# Altium project DUTBoard.PrjPcb (part 4 of 5)
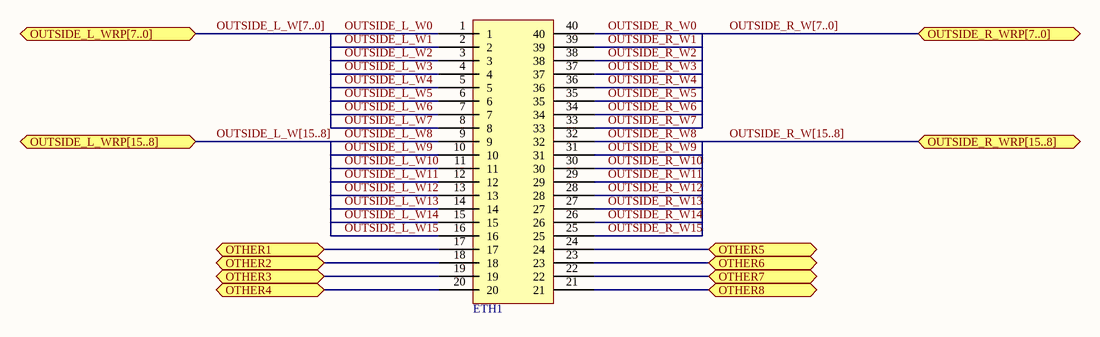
[diagram p14: BOTTOM_HEADER_WRP.SchDoc]
## Nets that join several sheets
GND: U_COUNTER_BANK/U_COUNTER_WRP (C4.GND), U_COUNTER_BANK/U_COUNTER_WRP (C3.GND), U_COUNTER_BANK/U_COUNTER_WRP (C2.GND), U_COUNTER_BANK/U_COUNTER_WRP (C1.GND), U_VT_BANK/U_VT_WRP (0.1uF_1#1.2 0.1uF_2#1.2 V14.GND), U_VT_BANK/U_VT_WRP (0.1uF_1#2.2 0.1uF_2#2.2 V13.GND), U_VT_BANK/U_VT_WRP (0.1uF_1#3.2 0.1uF_2#3.2 V16.GND), U_VT_BANK/U_VT_WRP (0.1uF_1#4.2 0.1uF_2#4.2 V15.GND), U_VT_BANK/U_VT_WRP (0.1uF_1#5.2 0.1uF_2#5.2 V12.GND), U_VT_BANK/U_VT_WRP (0.1uF_1#6.2 0.1uF_2#6.2 V11.GND), U_VT_BANK/U_VT_WRP (0.1uF_1#7.2 0.1uF_2#7.2 V10.GND), U_VT_BANK/U_VT_WRP (0.1uF_1#8.2 0.1uF_2#8.2 V9.GND), U_VT_BANK/U_VT_WRP (0.1uF_1#9.2 0.1uF_2#9.2 V8.GND), U_VT_BANK/U_VT_WRP (0.1uF_1#10.2 0.1uF_2#10.2 V7.GND), U_VT_BANK/U_VT_WRP (0.1uF_1#11.2 0.1uF_2#11.2 V6.GND), U_VT_BANK/U_VT_WRP (0.1uF_1#12.2 0.1uF_2#12.2 V5.GND), U_VT_BANK/U_VT_WRP (0.1uF_1#13.2 0.1uF_2#13.2 V4.GND), U_VT_BANK/U_VT_WRP (0.1uF_1_U_VT_BANK_U_VT_WRP#1.2 0.1uF_2#14.2 V3.GND), U_VT_BANK/U_VT_WRP (0.1uF_1_U_VT_BANK_U_VT_WRP#2.2 0.1uF_2#15.2 V2.GND), U_VT_BANK/U_VT_WRP (0.1uF_1#14.2 0.1uF_2#16.2 V1.GND), U_OB_BANK/U_OB_WRP (OB16.GND), U_OB_BANK/U_OB_WRP (OB15.GND), U_OB_BANK/U_OB_WRP (OB14.GND), U_OB_BANK/U_OB_WRP (OB13.GND), U_OB_BANK/U_OB_WRP (OB12.GND), U_OB_BANK/U_OB_WRP (OB11.GND), U_OB_BANK/U_OB_WRP (OB10.GND), U_OB_BANK/U_OB_WRP (OB9.GND), U_OB_BANK/U_OB_WRP (OB8.GND), U_OB_BANK/U_OB_WRP (OB7.GND), U_OB_BANK/U_OB_WRP (OB6.GND), U_OB_BANK/U_OB_WRP (OB5.GND), U_OB_BANK/U_OB_WRP (OB4.GND), U_OB_BANK/U_OB_WRP (OB3.GND), U_OB_BANK/U_OB_WRP (OB2.GND), U_OB_BANK/U_OB_WRP (OB1.GND), U_SRAM_BANK/U_SRAM_WRP (7 pins), U_SRAM_BANK/U_SRAM_WRP (7 pins), U_SRAM_BANK/U_SRAM_WRP (7 pins), U_SRAM_BANK/U_SRAM_WRP (7 pins), U_SRAM_BANK/U_SRAM_WRP (7 pins), U_SRAM_BANK/U_SRAM_WRP (7 pins), U_SRAM_BANK/U_SRAM_WRP (7 pins), U_SRAM_BANK/U_SRAM_WRP (7 pins), U_HEADER_BANK/U_COMBINED_HEADER_WRP/U_TOP_HEADER_WRP (8 pins), U_HEADER_BANK/U_COMBINED_HEADER_WRP/U_TOP_HEADER_WRP (8 pins), U_HEADER_BANK/U_COMBINED_HEADER_WRP/U_BOTTOM_HEADER_WRP (ETH1_U_BOTTOM_HEADER_WRP4.20 ETH1_U_BOTTOM_HEADER_WRP4.21), U_HEADER_BANK/U_COMBINED_HEADER_WRP/U_TOP_HEADER_WRP (8 pins), U_HEADER_BANK/U_COMBINED_HEADER_WRP/U_TOP_HEADER_WRP (8 pins), U_HEADER_BANK/U_COMBINED_HEADER_WRP/U_BOTTOM_HEADER_WRP (ETH1_U_BOTTOM_HEADER_WRP3.19 ETH1_U_BOTTOM_HEADER_WRP3.20 ETH1_U_BOTTOM_HEADER_WRP3.21), U_HEADER_BANK/U_COMBINED_HEADER_WRP/U_TOP_HEADER_WRP (8 pins), U_HEADER_BANK/U_COMBINED_HEADER_WRP/U_TOP_HEADER_WRP (8 pins), U_HEADER_BANK/U_COMBINED_HEADER_WRP/U_BOTTOM_HEADER_WRP (5 pins), U_HEADER_BANK/U_COMBINED_HEADER_WRP/U_TOP_HEADER_WRP (8 pins), U_HEADER_BANK/U_COMBINED_HEADER_WRP/U_TOP_HEADER_WRP (8 pins)
3V3: U_COUNTER_BANK/U_COUNTER_WRP (C4.VCC), U_COUNTER_BANK/U_COUNTER_WRP (C3.VCC), U_COUNTER_BANK/U_COUNTER_WRP (C2.VCC), U_COUNTER_BANK/U_COUNTER_WRP (C1.VCC), U_VT_BANK/U_VT_WRP (0.1uF_1#1.1 V14.VL), U_VT_BANK/U_VT_WRP (0.1uF_1#2.1 V13.VL), U_VT_BANK/U_VT_WRP (0.1uF_1#3.1 V16.VL), U_VT_BANK/U_VT_WRP (0.1uF_1#4.1 V15.VL), U_VT_BANK/U_VT_WRP (0.1uF_1#5.1 V12.VL), U_VT_BANK/U_VT_WRP (0.1uF_1#6.1 V11.VL), U_VT_BANK/U_VT_WRP (0.1uF_1#7.1 V10.VL), U_VT_BANK/U_VT_WRP (0.1uF_1#8.1 V9.VL), U_VT_BANK/U_VT_WRP (0.1uF_1#9.1 V8.VL), U_VT_BANK/U_VT_WRP (0.1uF_1#10.1 V7.VL), U_VT_BANK/U_VT_WRP (0.1uF_1#11.1 V6.VL), U_VT_BANK/U_VT_WRP (0.1uF_1#12.1 V5.VL), U_VT_BANK/U_VT_WRP (0.1uF_1#13.1 V4.VL), U_VT_BANK/U_VT_WRP (0.1uF_1_U_VT_BANK_U_VT_WRP#1.1 V3.VL), U_VT_BANK/U_VT_WRP (0.1uF_1_U_VT_BANK_U_VT_WRP#2.1 V2.VL), U_VT_BANK/U_VT_WRP (0.1uF_1#14.1 V1.VL), U_OB_BANK/U_OB_WRP (OB16.VCC), U_OB_BANK/U_OB_WRP (OB15.VCC), U_OB_BANK/U_OB_WRP (OB14.VCC), U_OB_BANK/U_OB_WRP (OB13.VCC), U_OB_BANK/U_OB_WRP (OB12.VCC), U_OB_BANK/U_OB_WRP (OB11.VCC), U_OB_BANK/U_OB_WRP (OB10.VCC), U_OB_BANK/U_OB_WRP (OB9.VCC), U_OB_BANK/U_OB_WRP (OB8.VCC), U_OB_BANK/U_OB_WRP (OB7.VCC), U_OB_BANK/U_OB_WRP (OB6.VCC), U_OB_BANK/U_OB_WRP (OB5.VCC), U_OB_BANK/U_OB_WRP (OB4.VCC), U_OB_BANK/U_OB_WRP (OB3.VCC), U_OB_BANK/U_OB_WRP (OB2.VCC), U_OB_BANK/U_OB_WRP (OB1.VCC), U_SRAM_BANK/U_SRAM_WRP (S7.VDD), U_SRAM_BANK/U_SRAM_WRP (S8.VDD), U_SRAM_BANK/U_SRAM_WRP (S6.VDD), U_SRAM_BANK/U_SRAM_WRP (S5.VDD), U_SRAM_BANK/U_SRAM_WRP (S4.VDD), U_SRAM_BANK/U_SRAM_WRP (S3.VDD), U_SRAM_BANK/U_SRAM_WRP (S2.VDD), U_SRAM_BANK/U_SRAM_WRP (S1.VDD), U_HEADER_BANK/U_COMBINED_HEADER_WRP/U_BOTTOM_HEADER_WRP (ETH1_U_BOTTOM_HEADER_WRP3.22)
ADDR_COUNTER_W0: U_COUNTER_BANK/U_COUNTER_WRP (C4.ADDR0), U_SRAM_BANK/U_SRAM_WRP (S7.ADDR0), U_SRAM_BANK/U_SRAM_WRP (S8.ADDR0)
ADDR_COUNTER_W0: U_COUNTER_BANK/U_COUNTER_WRP (C3.ADDR0), U_SRAM_BANK/U_SRAM_WRP (S6.ADDR0), U_SRAM_BANK/U_SRAM_WRP (S5.ADDR0)
ADDR_COUNTER_W0: U_COUNTER_BANK/U_COUNTER_WRP (C2.ADDR0), U_SRAM_BANK/U_SRAM_WRP (S4.ADDR0), U_SRAM_BANK/U_SRAM_WRP (S3.ADDR0)
ADDR_COUNTER_W0: U_COUNTER_BANK/U_COUNTER_WRP (C1.ADDR0), U_SRAM_BANK/U_SRAM_WRP (S2.ADDR0), U_SRAM_BANK/U_SRAM_WRP (S1.ADDR0)
ADDR_COUNTER_W1: U_COUNTER_BANK/U_COUNTER_WRP (C4.ADDR1), U_SRAM_BANK/U_SRAM_WRP (S7.ADDR1), U_SRAM_BANK/U_SRAM_WRP (S8.ADDR1)
ADDR_COUNTER_W1: U_COUNTER_BANK/U_COUNTER_WRP (C3.ADDR1), U_SRAM_BANK/U_SRAM_WRP (S6.ADDR1), U_SRAM_BANK/U_SRAM_WRP (S5.ADDR1)
ADDR_COUNTER_W1: U_COUNTER_BANK/U_COUNTER_WRP (C2.ADDR1), U_SRAM_BANK/U_SRAM_WRP (S4.ADDR1), U_SRAM_BANK/U_SRAM_WRP (S3.ADDR1)
ADDR_COUNTER_W1: U_COUNTER_BANK/U_COUNTER_WRP (C1.ADDR1), U_SRAM_BANK/U_SRAM_WRP (S2.ADDR1), U_SRAM_BANK/U_SRAM_WRP (S1.ADDR1)
ADDR_COUNTER_W2: U_COUNTER_BANK/U_COUNTER_WRP (C4.ADDR2), U_SRAM_BANK/U_SRAM_WRP (S7.ADDR2), U_SRAM_BANK/U_SRAM_WRP (S8.ADDR2)
ADDR_COUNTER_W2: U_COUNTER_BANK/U_COUNTER_WRP (C3.ADDR2), U_SRAM_BANK/U_SRAM_WRP (S6.ADDR2), U_SRAM_BANK/U_SRAM_WRP (S5.ADDR2)
ADDR_COUNTER_W2: U_COUNTER_BANK/U_COUNTER_WRP (C2.ADDR2), U_SRAM_BANK/U_SRAM_WRP (S4.ADDR2), U_SRAM_BANK/U_SRAM_WRP (S3.ADDR2)
ADDR_COUNTER_W2: U_COUNTER_BANK/U_COUNTER_WRP (C1.ADDR2), U_SRAM_BANK/U_SRAM_WRP (S2.ADDR2), U_SRAM_BANK/U_SRAM_WRP (S1.ADDR2)
ADDR_COUNTER_W3: U_COUNTER_BANK/U_COUNTER_WRP (C4.ADDR3), U_SRAM_BANK/U_SRAM_WRP (S7.ADDR3), U_SRAM_BANK/U_SRAM_WRP (S8.ADDR3)
ADDR_COUNTER_W3: U_COUNTER_BANK/U_COUNTER_WRP (C3.ADDR3), U_SRAM_BANK/U_SRAM_WRP (S6.ADDR3), U_SRAM_BANK/U_SRAM_WRP (S5.ADDR3)
ADDR_COUNTER_W3: U_COUNTER_BANK/U_COUNTER_WRP (C2.ADDR3), U_SRAM_BANK/U_SRAM_WRP (S4.ADDR3), U_SRAM_BANK/U_SRAM_WRP (S3.ADDR3)
ADDR_COUNTER_W3: U_COUNTER_BANK/U_COUNTER_WRP (C1.ADDR3), U_SRAM_BANK/U_SRAM_WRP (S2.ADDR3), U_SRAM_BANK/U_SRAM_WRP (S1.ADDR3)
ADDR_COUNTER_W4: U_COUNTER_BANK/U_COUNTER_WRP (C4.ADDR4), U_SRAM_BANK/U_SRAM_WRP (S7.ADDR4), U_SRAM_BANK/U_SRAM_WRP (S8.ADDR4)
ADDR_COUNTER_W4: U_COUNTER_BANK/U_COUNTER_WRP (C3.ADDR4), U_SRAM_BANK/U_SRAM_WRP (S6.ADDR4), U_SRAM_BANK/U_SRAM_WRP (S5.ADDR4)
ADDR_COUNTER_W4: U_COUNTER_BANK/U_COUNTER_WRP (C2.ADDR4), U_SRAM_BANK/U_SRAM_WRP (S4.ADDR4), U_SRAM_BANK/U_SRAM_WRP (S3.ADDR4)
ADDR_COUNTER_W4: U_COUNTER_BANK/U_COUNTER_WRP (C1.ADDR4), U_SRAM_BANK/U_SRAM_WRP (S2.ADDR4), U_SRAM_BANK/U_SRAM_WRP (S1.ADDR4)
ADDR_COUNTER_W5: U_COUNTER_BANK/U_COUNTER_WRP (C4.ADDR5), U_SRAM_BANK/U_SRAM_WRP (S7.ADDR5), U_SRAM_BANK/U_SRAM_WRP (S8.ADDR5)
ADDR_COUNTER_W5: U_COUNTER_BANK/U_COUNTER_WRP (C3.ADDR5), U_SRAM_BANK/U_SRAM_WRP (S6.ADDR5), U_SRAM_BANK/U_SRAM_WRP (S5.ADDR5)
ADDR_COUNTER_W5: U_COUNTER_BANK/U_COUNTER_WRP (C2.ADDR5), U_SRAM_BANK/U_SRAM_WRP (S4.ADDR5), U_SRAM_BANK/U_SRAM_WRP (S3.ADDR5)
ADDR_COUNTER_W5: U_COUNTER_BANK/U_COUNTER_WRP (C1.ADDR5), U_SRAM_BANK/U_SRAM_WRP (S2.ADDR5), U_SRAM_BANK/U_SRAM_WRP (S1.ADDR5)
ADDR_COUNTER_W6: U_COUNTER_BANK/U_COUNTER_WRP (C4.ADDR6), U_SRAM_BANK/U_SRAM_WRP (S7.ADDR6), U_SRAM_BANK/U_SRAM_WRP (S8.ADDR6)
ADDR_COUNTER_W6: U_COUNTER_BANK/U_COUNTER_WRP (C3.ADDR6), U_SRAM_BANK/U_SRAM_WRP (S6.ADDR6), U_SRAM_BANK/U_SRAM_WRP (S5.ADDR6)
ADDR_COUNTER_W6: U_COUNTER_BANK/U_COUNTER_WRP (C2.ADDR6), U_SRAM_BANK/U_SRAM_WRP (S4.ADDR6), U_SRAM_BANK/U_SRAM_WRP (S3.ADDR6)
ADDR_COUNTER_W6: U_COUNTER_BANK/U_COUNTER_WRP (C1.ADDR6), U_SRAM_BANK/U_SRAM_WRP (S2.ADDR6), U_SRAM_BANK/U_SRAM_WRP (S1.ADDR6)
ADDR_COUNTER_W7: U_COUNTER_BANK/U_COUNTER_WRP (C4.ADDR7), U_SRAM_BANK/U_SRAM_WRP (S7.ADDR7), U_SRAM_BANK/U_SRAM_WRP (S8.ADDR7)
ADDR_COUNTER_W7: U_COUNTER_BANK/U_COUNTER_WRP (C3.ADDR7), U_SRAM_BANK/U_SRAM_WRP (S6.ADDR7), U_SRAM_BANK/U_SRAM_WRP (S5.ADDR7)
ADDR_COUNTER_W7: U_COUNTER_BANK/U_COUNTER_WRP (C2.ADDR7), U_SRAM_BANK/U_SRAM_WRP (S4.ADDR7), U_SRAM_BANK/U_SRAM_WRP (S3.ADDR7)
ADDR_COUNTER_W7: U_COUNTER_BANK/U_COUNTER_WRP (C1.ADDR7), U_SRAM_BANK/U_SRAM_WRP (S2.ADDR7), U_SRAM_BANK/U_SRAM_WRP (S1.ADDR7)
ADDR_COUNTER_W8: U_COUNTER_BANK/U_COUNTER_WRP (C4.ADDR8), U_SRAM_BANK/U_SRAM_WRP (S7.ADDR8), U_SRAM_BANK/U_SRAM_WRP (S8.ADDR8)
ADDR_COUNTER_W8: U_COUNTER_BANK/U_COUNTER_WRP (C3.ADDR8), U_SRAM_BANK/U_SRAM_WRP (S6.ADDR8), U_SRAM_BANK/U_SRAM_WRP (S5.ADDR8)
ADDR_COUNTER_W8: U_COUNTER_BANK/U_COUNTER_WRP (C2.ADDR8), U_SRAM_BANK/U_SRAM_WRP (S4.ADDR8), U_SRAM_BANK/U_SRAM_WRP (S3.ADDR8)
ADDR_COUNTER_W8: U_COUNTER_BANK/U_COUNTER_WRP (C1.ADDR8), U_SRAM_BANK/U_SRAM_WRP (S2.ADDR8), U_SRAM_BANK/U_SRAM_WRP (S1.ADDR8)
ADDR_COUNTER_W9: U_COUNTER_BANK/U_COUNTER_WRP (C4.ADDR9), U_SRAM_BANK/U_SRAM_WRP (S7.ADDR9), U_SRAM_BANK/U_SRAM_WRP (S8.ADDR9)
ADDR_COUNTER_W9: U_COUNTER_BANK/U_COUNTER_WRP (C3.ADDR9), U_SRAM_BANK/U_SRAM_WRP (S6.ADDR9), U_SRAM_BANK/U_SRAM_WRP (S5.ADDR9)
ADDR_COUNTER_W9: U_COUNTER_BANK/U_COUNTER_WRP (C2.ADDR9), U_SRAM_BANK/U_SRAM_WRP (S4.ADDR9), U_SRAM_BANK/U_SRAM_WRP (S3.ADDR9)
ADDR_COUNTER_W9: U_COUNTER_BANK/U_COUNTER_WRP (C1.ADDR9), U_SRAM_BANK/U_SRAM_WRP (S2.ADDR9), U_SRAM_BANK/U_SRAM_WRP (S1.ADDR9)
ADDR_COUNTER_W10: U_COUNTER_BANK/U_COUNTER_WRP (C4.ADDR10), U_SRAM_BANK/U_SRAM_WRP (S7.ADDR10), U_SRAM_BANK/U_SRAM_WRP (S8.ADDR10)
ADDR_COUNTER_W10: U_COUNTER_BANK/U_COUNTER_WRP (C3.ADDR10), U_SRAM_BANK/U_SRAM_WRP (S6.ADDR10), U_SRAM_BANK/U_SRAM_WRP (S5.ADDR10)
ADDR_COUNTER_W10: U_COUNTER_BANK/U_COUNTER_WRP (C2.ADDR10), U_SRAM_BANK/U_SRAM_WRP (S4.ADDR10), U_SRAM_BANK/U_SRAM_WRP (S3.ADDR10)
ADDR_COUNTER_W10: U_COUNTER_BANK/U_COUNTER_WRP (C1.ADDR10), U_SRAM_BANK/U_SRAM_WRP (S2.ADDR10), U_SRAM_BANK/U_SRAM_WRP (S1.ADDR10)
ADDR_COUNTER_W11: U_COUNTER_BANK/U_COUNTER_WRP (C4.ADDR11), U_SRAM_BANK/U_SRAM_WRP (S7.ADDR11), U_SRAM_BANK/U_SRAM_WRP (S8.ADDR11)
ADDR_COUNTER_W11: U_COUNTER_BANK/U_COUNTER_WRP (C3.ADDR11), U_SRAM_BANK/U_SRAM_WRP (S6.ADDR11), U_SRAM_BANK/U_SRAM_WRP (S5.ADDR11)
ADDR_COUNTER_W11: U_COUNTER_BANK/U_COUNTER_WRP (C2.ADDR11), U_SRAM_BANK/U_SRAM_WRP (S4.ADDR11), U_SRAM_BANK/U_SRAM_WRP (S3.ADDR11)
ADDR_COUNTER_W11: U_COUNTER_BANK/U_COUNTER_WRP (C1.ADDR11), U_SRAM_BANK/U_SRAM_WRP (S2.ADDR11), U_SRAM_BANK/U_SRAM_WRP (S1.ADDR11)
CLK_1: U_COUNTER_BANK/U_COUNTER_WRP (C4.~CLK), U_HEADER_BANK/U_COMBINED_HEADER_WRP/U_BOTTOM_HEADER_WRP (ETH1_U_BOTTOM_HEADER_WRP4.17)
CLK_2: U_COUNTER_BANK/U_COUNTER_WRP (C3.~CLK), U_HEADER_BANK/U_COMBINED_HEADER_WRP/U_BOTTOM_HEADER_WRP (ETH1_U_BOTTOM_HEADER_WRP3.17)
CLK_3: U_COUNTER_BANK/U_COUNTER_WRP (C2.~CLK), U_HEADER_BANK/U_COMBINED_HEADER_WRP/U_BOTTOM_HEADER_WRP (ETH1_U_BOTTOM_HEADER_WRP2.17)
CLK_4: U_COUNTER_BANK/U_COUNTER_WRP (C1.~CLK), U_HEADER_BANK/U_COMBINED_HEADER_WRP/U_BOTTOM_HEADER_WRP (ETH1_U_BOTTOM_HEADER_WRP1.17)
CLR_COUNTER_W: U_COUNTER_BANK/U_COUNTER_WRP (C4.CLR), U_COUNTER_BANK/U_COUNTER_WRP (C3.CLR), U_COUNTER_BANK/U_COUNTER_WRP (C2.CLR), U_COUNTER_BANK/U_COUNTER_WRP (C1.CLR), U_HEADER_BANK/U_COMBINED_HEADER_WRP/U_BOTTOM_HEADER_WRP (ETH1_U_BOTTOM_HEADER_WRP4.18)
D_W0: U_VT_BANK/U_VT_WRP (V14.OVL0), U_OB_BANK/U_OB_WRP (OB16.D0), U_SRAM_BANK/U_SRAM_WRP (S7.DATA0)
D_W0: U_VT_BANK/U_VT_WRP (V13.OVL0), U_OB_BANK/U_OB_WRP (OB15.D0), U_SRAM_BANK/U_SRAM_WRP (S7.DATA8)
D_W0: U_VT_BANK/U_VT_WRP (V16.OVL0), U_OB_BANK/U_OB_WRP (OB14.D0), U_SRAM_BANK/U_SRAM_WRP (S8.DATA0)
D_W0: U_VT_BANK/U_VT_WRP (V15.OVL0), U_OB_BANK/U_OB_WRP (OB13.D0), U_SRAM_BANK/U_SRAM_WRP (S8.DATA8)
D_W0: U_VT_BANK/U_VT_WRP (V12.OVL0), U_OB_BANK/U_OB_WRP (OB12.D0), U_SRAM_BANK/U_SRAM_WRP (S6.DATA0)
D_W0: U_VT_BANK/U_VT_WRP (V11.OVL0), U_OB_BANK/U_OB_WRP (OB11.D0), U_SRAM_BANK/U_SRAM_WRP (S6.DATA8)
D_W0: U_VT_BANK/U_VT_WRP (V10.OVL0), U_OB_BANK/U_OB_WRP (OB10.D0), U_SRAM_BANK/U_SRAM_WRP (S5.DATA0)
D_W0: U_VT_BANK/U_VT_WRP (V9.OVL0), U_OB_BANK/U_OB_WRP (OB9.D0), U_SRAM_BANK/U_SRAM_WRP (S5.DATA8)
D_W0: U_VT_BANK/U_VT_WRP (V8.OVL0), U_OB_BANK/U_OB_WRP (OB8.D0), U_SRAM_BANK/U_SRAM_WRP (S4.DATA0)
D_W0: U_VT_BANK/U_VT_WRP (V7.OVL0), U_OB_BANK/U_OB_WRP (OB7.D0), U_SRAM_BANK/U_SRAM_WRP (S4.DATA8)
D_W0: U_VT_BANK/U_VT_WRP (V6.OVL0), U_OB_BANK/U_OB_WRP (OB6.D0), U_SRAM_BANK/U_SRAM_WRP (S3.DATA0)
D_W0: U_VT_BANK/U_VT_WRP (V5.OVL0), U_OB_BANK/U_OB_WRP (OB5.D0), U_SRAM_BANK/U_SRAM_WRP (S3.DATA8)
D_W0: U_VT_BANK/U_VT_WRP (V4.OVL0), U_OB_BANK/U_OB_WRP (OB4.D0), U_SRAM_BANK/U_SRAM_WRP (S2.DATA0)
D_W0: U_VT_BANK/U_VT_WRP (V3.OVL0), U_OB_BANK/U_OB_WRP (OB3.D0), U_SRAM_BANK/U_SRAM_WRP (S2.DATA8)
D_W0: U_VT_BANK/U_VT_WRP (V2.OVL0), U_OB_BANK/U_OB_WRP (OB2.D0), U_SRAM_BANK/U_SRAM_WRP (S1.DATA0)
D_W0: U_VT_BANK/U_VT_WRP (V1.OVL0), U_OB_BANK/U_OB_WRP (OB1.D0), U_SRAM_BANK/U_SRAM_WRP (S1.DATA8)
D_W1: U_VT_BANK/U_VT_WRP (V14.OVL1), U_OB_BANK/U_OB_WRP (OB16.D1), U_SRAM_BANK/U_SRAM_WRP (S7.DATA1)
D_W1: U_VT_BANK/U_VT_WRP (V13.OVL1), U_OB_BANK/U_OB_WRP (OB15.D1), U_SRAM_BANK/U_SRAM_WRP (S7.DATA9)
D_W1: U_VT_BANK/U_VT_WRP (V16.OVL1), U_OB_BANK/U_OB_WRP (OB14.D1), U_SRAM_BANK/U_SRAM_WRP (S8.DATA1)
D_W1: U_VT_BANK/U_VT_WRP (V15.OVL1), U_OB_BANK/U_OB_WRP (OB13.D1), U_SRAM_BANK/U_SRAM_WRP (S8.DATA9)
D_W1: U_VT_BANK/U_VT_WRP (V12.OVL1), U_OB_BANK/U_OB_WRP (OB12.D1), U_SRAM_BANK/U_SRAM_WRP (S6.DATA1)
D_W1: U_VT_BANK/U_VT_WRP (V11.OVL1), U_OB_BANK/U_OB_WRP (OB11.D1), U_SRAM_BANK/U_SRAM_WRP (S6.DATA9)
D_W1: U_VT_BANK/U_VT_WRP (V10.OVL1), U_OB_BANK/U_OB_WRP (OB10.D1), U_SRAM_BANK/U_SRAM_WRP (S5.DATA1)
D_W1: U_VT_BANK/U_VT_WRP (V9.OVL1), U_OB_BANK/U_OB_WRP (OB9.D1), U_SRAM_BANK/U_SRAM_WRP (S5.DATA9)
D_W1: U_VT_BANK/U_VT_WRP (V8.OVL1), U_OB_BANK/U_OB_WRP (OB8.D1), U_SRAM_BANK/U_SRAM_WRP (S4.DATA1)
D_W1: U_VT_BANK/U_VT_WRP (V7.OVL1), U_OB_BANK/U_OB_WRP (OB7.D1), U_SRAM_BANK/U_SRAM_WRP (S4.DATA9)
D_W1: U_VT_BANK/U_VT_WRP (V6.OVL1), U_OB_BANK/U_OB_WRP (OB6.D1), U_SRAM_BANK/U_SRAM_WRP (S3.DATA1)
D_W1: U_VT_BANK/U_VT_WRP (V5.OVL1), U_OB_BANK/U_OB_WRP (OB5.D1), U_SRAM_BANK/U_SRAM_WRP (S3.DATA9)
D_W1: U_VT_BANK/U_VT_WRP (V4.OVL1), U_OB_BANK/U_OB_WRP (OB4.D1), U_SRAM_BANK/U_SRAM_WRP (S2.DATA1)
D_W1: U_VT_BANK/U_VT_WRP (V3.OVL1), U_OB_BANK/U_OB_WRP (OB3.D1), U_SRAM_BANK/U_SRAM_WRP (S2.DATA9)
D_W1: U_VT_BANK/U_VT_WRP (V2.OVL1), U_OB_BANK/U_OB_WRP (OB2.D1), U_SRAM_BANK/U_SRAM_WRP (S1.DATA1)
D_W1: U_VT_BANK/U_VT_WRP (V1.OVL1), U_OB_BANK/U_OB_WRP (OB1.D1), U_SRAM_BANK/U_SRAM_WRP (S1.DATA9)
D_W2: U_VT_BANK/U_VT_WRP (V14.OVL2), U_OB_BANK/U_OB_WRP (OB16.D2), U_SRAM_BANK/U_SRAM_WRP (S7.DATA2)
D_W2: U_VT_BANK/U_VT_WRP (V13.OVL2), U_OB_BANK/U_OB_WRP (OB15.D2), U_SRAM_BANK/U_SRAM_WRP (S7.DATA10)
D_W2: U_VT_BANK/U_VT_WRP (V16.OVL2), U_OB_BANK/U_OB_WRP (OB14.D2), U_SRAM_BANK/U_SRAM_WRP (S8.DATA2)
D_W2: U_VT_BANK/U_VT_WRP (V15.OVL2), U_OB_BANK/U_OB_WRP (OB13.D2), U_SRAM_BANK/U_SRAM_WRP (S8.DATA10)
D_W2: U_VT_BANK/U_VT_WRP (V12.OVL2), U_OB_BANK/U_OB_WRP (OB12.D2), U_SRAM_BANK/U_SRAM_WRP (S6.DATA2)
D_W2: U_VT_BANK/U_VT_WRP (V11.OVL2), U_OB_BANK/U_OB_WRP (OB11.D2), U_SRAM_BANK/U_SRAM_WRP (S6.DATA10)
D_W2: U_VT_BANK/U_VT_WRP (V10.OVL2), U_OB_BANK/U_OB_WRP (OB10.D2), U_SRAM_BANK/U_SRAM_WRP (S5.DATA2)
D_W2: U_VT_BANK/U_VT_WRP (V9.OVL2), U_OB_BANK/U_OB_WRP (OB9.D2), U_SRAM_BANK/U_SRAM_WRP (S5.DATA10)
D_W2: U_VT_BANK/U_VT_WRP (V8.OVL2), U_OB_BANK/U_OB_WRP (OB8.D2), U_SRAM_BANK/U_SRAM_WRP (S4.DATA2)
D_W2: U_VT_BANK/U_VT_WRP (V7.OVL2), U_OB_BANK/U_OB_WRP (OB7.D2), U_SRAM_BANK/U_SRAM_WRP (S4.DATA10)
D_W2: U_VT_BANK/U_VT_WRP (V6.OVL2), U_OB_BANK/U_OB_WRP (OB6.D2), U_SRAM_BANK/U_SRAM_WRP (S3.DATA2)
D_W2: U_VT_BANK/U_VT_WRP (V5.OVL2), U_OB_BANK/U_OB_WRP (OB5.D2), U_SRAM_BANK/U_SRAM_WRP (S3.DATA10)
D_W2: U_VT_BANK/U_VT_WRP (V4.OVL2), U_OB_BANK/U_OB_WRP (OB4.D2), U_SRAM_BANK/U_SRAM_WRP (S2.DATA2)
D_W2: U_VT_BANK/U_VT_WRP (V3.OVL2), U_OB_BANK/U_OB_WRP (OB3.D2), U_SRAM_BANK/U_SRAM_WRP (S2.DATA10)
D_W2: U_VT_BANK/U_VT_WRP (V2.OVL2), U_OB_BANK/U_OB_WRP (OB2.D2), U_SRAM_BANK/U_SRAM_WRP (S1.DATA2)
D_W2: U_VT_BANK/U_VT_WRP (V1.OVL2), U_OB_BANK/U_OB_WRP (OB1.D2), U_SRAM_BANK/U_SRAM_WRP (S1.DATA10)
D_W3: U_VT_BANK/U_VT_WRP (V14.OVL3), U_OB_BANK/U_OB_WRP (OB16.D3), U_SRAM_BANK/U_SRAM_WRP (S7.DATA3)
D_W3: U_VT_BANK/U_VT_WRP (V13.OVL3), U_OB_BANK/U_OB_WRP (OB15.D3), U_SRAM_BANK/U_SRAM_WRP (S7.DATA11)
D_W3: U_VT_BANK/U_VT_WRP (V16.OVL3), U_OB_BANK/U_OB_WRP (OB14.D3), U_SRAM_BANK/U_SRAM_WRP (S8.DATA3)
D_W3: U_VT_BANK/U_VT_WRP (V15.OVL3), U_OB_BANK/U_OB_WRP (OB13.D3), U_SRAM_BANK/U_SRAM_WRP (S8.DATA11)
D_W3: U_VT_BANK/U_VT_WRP (V12.OVL3), U_OB_BANK/U_OB_WRP (OB12.D3), U_SRAM_BANK/U_SRAM_WRP (S6.DATA3)
D_W3: U_VT_BANK/U_VT_WRP (V11.OVL3), U_OB_BANK/U_OB_WRP (OB11.D3), U_SRAM_BANK/U_SRAM_WRP (S6.DATA11)
D_W3: U_VT_BANK/U_VT_WRP (V10.OVL3), U_OB_BANK/U_OB_WRP (OB10.D3), U_SRAM_BANK/U_SRAM_WRP (S5.DATA3)
D_W3: U_VT_BANK/U_VT_WRP (V9.OVL3), U_OB_BANK/U_OB_WRP (OB9.D3), U_SRAM_BANK/U_SRAM_WRP (S5.DATA11)
D_W3: U_VT_BANK/U_VT_WRP (V8.OVL3), U_OB_BANK/U_OB_WRP (OB8.D3), U_SRAM_BANK/U_SRAM_WRP (S4.DATA3)
D_W3: U_VT_BANK/U_VT_WRP (V7.OVL3), U_OB_BANK/U_OB_WRP (OB7.D3), U_SRAM_BANK/U_SRAM_WRP (S4.DATA11)
D_W3: U_VT_BANK/U_VT_WRP (V6.OVL3), U_OB_BANK/U_OB_WRP (OB6.D3), U_SRAM_BANK/U_SRAM_WRP (S3.DATA3)
D_W3: U_VT_BANK/U_VT_WRP (V5.OVL3), U_OB_BANK/U_OB_WRP (OB5.D3), U_SRAM_BANK/U_SRAM_WRP (S3.DATA11)
D_W3: U_VT_BANK/U_VT_WRP (V4.OVL3), U_OB_BANK/U_OB_WRP (OB4.D3), U_SRAM_BANK/U_SRAM_WRP (S2.DATA3)
D_W3: U_VT_BANK/U_VT_WRP (V3.OVL3), U_OB_BANK/U_OB_WRP (OB3.D3), U_SRAM_BANK/U_SRAM_WRP (S2.DATA11)
D_W3: U_VT_BANK/U_VT_WRP (V2.OVL3), U_OB_BANK/U_OB_WRP (OB2.D3), U_SRAM_BANK/U_SRAM_WRP (S1.DATA3)
D_W3: U_VT_BANK/U_VT_WRP (V1.OVL3), U_OB_BANK/U_OB_WRP (OB1.D3), U_SRAM_BANK/U_SRAM_WRP (S1.DATA11)
D_W4: U_VT_BANK/U_VT_WRP (V14.OVL4), U_OB_BANK/U_OB_WRP (OB16.D4), U_SRAM_BANK/U_SRAM_WRP (S7.DATA4)
D_W4: U_VT_BANK/U_VT_WRP (V13.OVL4), U_OB_BANK/U_OB_WRP (OB15.D4), U_SRAM_BANK/U_SRAM_WRP (S7.DATA12)
D_W4: U_VT_BANK/U_VT_WRP (V16.OVL4), U_OB_BANK/U_OB_WRP (OB14.D4), U_SRAM_BANK/U_SRAM_WRP (S8.DATA4)
D_W4: U_VT_BANK/U_VT_WRP (V15.OVL4), U_OB_BANK/U_OB_WRP (OB13.D4), U_SRAM_BANK/U_SRAM_WRP (S8.DATA12)
D_W4: U_VT_BANK/U_VT_WRP (V12.OVL4), U_OB_BANK/U_OB_WRP (OB12.D4), U_SRAM_BANK/U_SRAM_WRP (S6.DATA4)
D_W4: U_VT_BANK/U_VT_WRP (V11.OVL4), U_OB_BANK/U_OB_WRP (OB11.D4), U_SRAM_BANK/U_SRAM_WRP (S6.DATA12)
D_W4: U_VT_BANK/U_VT_WRP (V10.OVL4), U_OB_BANK/U_OB_WRP (OB10.D4), U_SRAM_BANK/U_SRAM_WRP (S5.DATA4)
D_W4: U_VT_BANK/U_VT_WRP (V9.OVL4), U_OB_BANK/U_OB_WRP (OB9.D4), U_SRAM_BANK/U_SRAM_WRP (S5.DATA12)
D_W4: U_VT_BANK/U_VT_WRP (V8.OVL4), U_OB_BANK/U_OB_WRP (OB8.D4), U_SRAM_BANK/U_SRAM_WRP (S4.DATA4)
D_W4: U_VT_BANK/U_VT_WRP (V7.OVL4), U_OB_BANK/U_OB_WRP (OB7.D4), U_SRAM_BANK/U_SRAM_WRP (S4.DATA12)
D_W4: U_VT_BANK/U_VT_WRP (V6.OVL4), U_OB_BANK/U_OB_WRP (OB6.D4), U_SRAM_BANK/U_SRAM_WRP (S3.DATA4)
D_W4: U_VT_BANK/U_VT_WRP (V5.OVL4), U_OB_BANK/U_OB_WRP (OB5.D4), U_SRAM_BANK/U_SRAM_WRP (S3.DATA12)
D_W4: U_VT_BANK/U_VT_WRP (V4.OVL4), U_OB_BANK/U_OB_WRP (OB4.D4), U_SRAM_BANK/U_SRAM_WRP (S2.DATA4)
D_W4: U_VT_BANK/U_VT_WRP (V3.OVL4), U_OB_BANK/U_OB_WRP (OB3.D4), U_SRAM_BANK/U_SRAM_WRP (S2.DATA12)
D_W4: U_VT_BANK/U_VT_WRP (V2.OVL4), U_OB_BANK/U_OB_WRP (OB2.D4), U_SRAM_BANK/U_SRAM_WRP (S1.DATA4)
D_W4: U_VT_BANK/U_VT_WRP (V1.OVL4), U_OB_BANK/U_OB_WRP (OB1.D4), U_SRAM_BANK/U_SRAM_WRP (S1.DATA12)
D_W5: U_VT_BANK/U_VT_WRP (V14.OVL5), U_OB_BANK/U_OB_WRP (OB16.D5), U_SRAM_BANK/U_SRAM_WRP (S7.DATA5)
D_W5: U_VT_BANK/U_VT_WRP (V13.OVL5), U_OB_BANK/U_OB_WRP (OB15.D5), U_SRAM_BANK/U_SRAM_WRP (S7.DATA13)
D_W5: U_VT_BANK/U_VT_WRP (V16.OVL5), U_OB_BANK/U_OB_WRP (OB14.D5), U_SRAM_BANK/U_SRAM_WRP (S8.DATA5)
D_W5: U_VT_BANK/U_VT_WRP (V15.OVL5), U_OB_BANK/U_OB_WRP (OB13.D5), U_SRAM_BANK/U_SRAM_WRP (S8.DATA13)
D_W5: U_VT_BANK/U_VT_WRP (V12.OVL5), U_OB_BANK/U_OB_WRP (OB12.D5), U_SRAM_BANK/U_SRAM_WRP (S6.DATA5)
D_W5: U_VT_BANK/U_VT_WRP (V11.OVL5), U_OB_BANK/U_OB_WRP (OB11.D5), U_SRAM_BANK/U_SRAM_WRP (S6.DATA13)
D_W5: U_VT_BANK/U_VT_WRP (V10.OVL5), U_OB_BANK/U_OB_WRP (OB10.D5), U_SRAM_BANK/U_SRAM_WRP (S5.DATA5)
D_W5: U_VT_BANK/U_VT_WRP (V9.OVL5), U_OB_BANK/U_OB_WRP (OB9.D5), U_SRAM_BANK/U_SRAM_WRP (S5.DATA13)
D_W5: U_VT_BANK/U_VT_WRP (V8.OVL5), U_OB_BANK/U_OB_WRP (OB8.D5), U_SRAM_BANK/U_SRAM_WRP (S4.DATA5)
D_W5: U_VT_BANK/U_VT_WRP (V7.OVL5), U_OB_BANK/U_OB_WRP (OB7.D5), U_SRAM_BANK/U_SRAM_WRP (S4.DATA13)
D_W5: U_VT_BANK/U_VT_WRP (V6.OVL5), U_OB_BANK/U_OB_WRP (OB6.D5), U_SRAM_BANK/U_SRAM_WRP (S3.DATA5)
D_W5: U_VT_BANK/U_VT_WRP (V5.OVL5), U_OB_BANK/U_OB_WRP (OB5.D5), U_SRAM_BANK/U_SRAM_WRP (S3.DATA13)
D_W5: U_VT_BANK/U_VT_WRP (V4.OVL5), U_OB_BANK/U_OB_WRP (OB4.D5), U_SRAM_BANK/U_SRAM_WRP (S2.DATA5)
D_W5: U_VT_BANK/U_VT_WRP (V3.OVL5), U_OB_BANK/U_OB_WRP (OB3.D5), U_SRAM_BANK/U_SRAM_WRP (S2.DATA13)
D_W5: U_VT_BANK/U_VT_WRP (V2.OVL5), U_OB_BANK/U_OB_WRP (OB2.D5), U_SRAM_BANK/U_SRAM_WRP (S1.DATA5)
D_W5: U_VT_BANK/U_VT_WRP (V1.OVL5), U_OB_BANK/U_OB_WRP (OB1.D5), U_SRAM_BANK/U_SRAM_WRP (S1.DATA13)
D_W6: U_VT_BANK/U_VT_WRP (V14.OVL6), U_OB_BANK/U_OB_WRP (OB16.D6), U_SRAM_BANK/U_SRAM_WRP (S7.DATA6)
D_W6: U_VT_BANK/U_VT_WRP (V13.OVL6), U_OB_BANK/U_OB_WRP (OB15.D6), U_SRAM_BANK/U_SRAM_WRP (S7.DATA14)
D_W6: U_VT_BANK/U_VT_WRP (V16.OVL6), U_OB_BANK/U_OB_WRP (OB14.D6), U_SRAM_BANK/U_SRAM_WRP (S8.DATA6)
D_W6: U_VT_BANK/U_VT_WRP (V15.OVL6), U_OB_BANK/U_OB_WRP (OB13.D6), U_SRAM_BANK/U_SRAM_WRP (S8.DATA14)
D_W6: U_VT_BANK/U_VT_WRP (V12.OVL6), U_OB_BANK/U_OB_WRP (OB12.D6), U_SRAM_BANK/U_SRAM_WRP (S6.DATA6)
D_W6: U_VT_BANK/U_VT_WRP (V11.OVL6), U_OB_BANK/U_OB_WRP (OB11.D6), U_SRAM_BANK/U_SRAM_WRP (S6.DATA14)
D_W6: U_VT_BANK/U_VT_WRP (V10.OVL6), U_OB_BANK/U_OB_WRP (OB10.D6), U_SRAM_BANK/U_SRAM_WRP (S5.DATA6)
D_W6: U_VT_BANK/U_VT_WRP (V9.OVL6), U_OB_BANK/U_OB_WRP (OB9.D6), U_SRAM_BANK/U_SRAM_WRP (S5.DATA14)
D_W6: U_VT_BANK/U_VT_WRP (V8.OVL6), U_OB_BANK/U_OB_WRP (OB8.D6), U_SRAM_BANK/U_SRAM_WRP (S4.DATA6)
D_W6: U_VT_BANK/U_VT_WRP (V7.OVL6), U_OB_BANK/U_OB_WRP (OB7.D6), U_SRAM_BANK/U_SRAM_WRP (S4.DATA14)
D_W6: U_VT_BANK/U_VT_WRP (V6.OVL6), U_OB_BANK/U_OB_WRP (OB6.D6), U_SRAM_BANK/U_SRAM_WRP (S3.DATA6)
D_W6: U_VT_BANK/U_VT_WRP (V5.OVL6), U_OB_BANK/U_OB_WRP (OB5.D6), U_SRAM_BANK/U_SRAM_WRP (S3.DATA14)
D_W6: U_VT_BANK/U_VT_WRP (V4.OVL6), U_OB_BANK/U_OB_WRP (OB4.D6), U_SRAM_BANK/U_SRAM_WRP (S2.DATA6)
D_W6: U_VT_BANK/U_VT_WRP (V3.OVL6), U_OB_BANK/U_OB_WRP (OB3.D6), U_SRAM_BANK/U_SRAM_WRP (S2.DATA14)
D_W6: U_VT_BANK/U_VT_WRP (V2.OVL6), U_OB_BANK/U_OB_WRP (OB2.D6), U_SRAM_BANK/U_SRAM_WRP (S1.DATA6)
D_W6: U_VT_BANK/U_VT_WRP (V1.OVL6), U_OB_BANK/U_OB_WRP (OB1.D6), U_SRAM_BANK/U_SRAM_WRP (S1.DATA14)
D_W7: U_VT_BANK/U_VT_WRP (V14.OVL7), U_OB_BANK/U_OB_WRP (OB16.D7), U_SRAM_BANK/U_SRAM_WRP (S7.DATA7)
D_W7: U_VT_BANK/U_VT_WRP (V13.OVL7), U_OB_BANK/U_OB_WRP (OB15.D7), U_SRAM_BANK/U_SRAM_WRP (S7.DATA15)
D_W7: U_VT_BANK/U_VT_WRP (V16.OVL7), U_OB_BANK/U_OB_WRP (OB14.D7), U_SRAM_BANK/U_SRAM_WRP (S8.DATA7)
D_W7: U_VT_BANK/U_VT_WRP (V15.OVL7), U_OB_BANK/U_OB_WRP (OB13.D7), U_SRAM_BANK/U_SRAM_WRP (S8.DATA15)
D_W7: U_VT_BANK/U_VT_WRP (V12.OVL7), U_OB_BANK/U_OB_WRP (OB12.D7), U_SRAM_BANK/U_SRAM_WRP (S6.DATA7)
D_W7: U_VT_BANK/U_VT_WRP (V11.OVL7), U_OB_BANK/U_OB_WRP (OB11.D7), U_SRAM_BANK/U_SRAM_WRP (S6.DATA15)
D_W7: U_VT_BANK/U_VT_WRP (V10.OVL7), U_OB_BANK/U_OB_WRP (OB10.D7), U_SRAM_BANK/U_SRAM_WRP (S5.DATA7)
D_W7: U_VT_BANK/U_VT_WRP (V9.OVL7), U_OB_BANK/U_OB_WRP (OB9.D7), U_SRAM_BANK/U_SRAM_WRP (S5.DATA15)
D_W7: U_VT_BANK/U_VT_WRP (V8.OVL7), U_OB_BANK/U_OB_WRP (OB8.D7), U_SRAM_BANK/U_SRAM_WRP (S4.DATA7)
D_W7: U_VT_BANK/U_VT_WRP (V7.OVL7), U_OB_BANK/U_OB_WRP (OB7.D7), U_SRAM_BANK/U_SRAM_WRP (S4.DATA15)
D_W7: U_VT_BANK/U_VT_WRP (V6.OVL7), U_OB_BANK/U_OB_WRP (OB6.D7), U_SRAM_BANK/U_SRAM_WRP (S3.DATA7)
D_W7: U_VT_BANK/U_VT_WRP (V5.OVL7), U_OB_BANK/U_OB_WRP (OB5.D7), U_SRAM_BANK/U_SRAM_WRP (S3.DATA15)
D_W7: U_VT_BANK/U_VT_WRP (V4.OVL7), U_OB_BANK/U_OB_WRP (OB4.D7), U_SRAM_BANK/U_SRAM_WRP (S2.DATA7)
D_W7: U_VT_BANK/U_VT_WRP (V3.OVL7), U_OB_BANK/U_OB_WRP (OB3.D7), U_SRAM_BANK/U_SRAM_WRP (S2.DATA15)
D_W7: U_VT_BANK/U_VT_WRP (V2.OVL7), U_OB_BANK/U_OB_WRP (OB2.D7), U_SRAM_BANK/U_SRAM_WRP (S1.DATA7)
D_W7: U_VT_BANK/U_VT_WRP (V1.OVL7), U_OB_BANK/U_OB_WRP (OB1.D7), U_SRAM_BANK/U_SRAM_WRP (S1.DATA15)
EN: U_VT_BANK/U_VT_WRP (V14.EN), U_VT_BANK/U_VT_WRP (V13.EN), U_VT_BANK/U_VT_WRP (V16.EN), U_VT_BANK/U_VT_WRP (V15.EN), U_VT_BANK/U_VT_WRP (V12.EN), U_VT_BANK/U_VT_WRP (V11.EN), U_VT_BANK/U_VT_WRP (V10.EN), U_VT_BANK/U_VT_WRP (V9.EN), U_VT_BANK/U_VT_WRP (V8.EN), U_VT_BANK/U_VT_WRP (V7.EN), U_VT_BANK/U_VT_WRP (V6.EN), U_VT_BANK/U_VT_WRP (V5.EN), U_VT_BANK/U_VT_WRP (V4.EN), U_VT_BANK/U_VT_WRP (V3.EN), U_VT_BANK/U_VT_WRP (V2.EN), U_VT_BANK/U_VT_WRP (V1.EN), U_HEADER_BANK/U_COMBINED_HEADER_WRP/U_BOTTOM_HEADER_WRP (ETH1_U_BOTTOM_HEADER_WRP4.19)
FPGA_Q: U_OB_BANK/U_OB_WRP (OB1.Q), U_HEADER_BANK/U_COMBINED_HEADER_WRP/U_BOTTOM_HEADER_WRP (ETH1_U_BOTTOM_HEADER_WRP1.21)
FPGA_SHCP: U_OB_BANK/U_OB_WRP (OB16.SHCP), U_OB_BANK/U_OB_WRP (OB15.SHCP), U_OB_BANK/U_OB_WRP (OB14.SHCP), U_OB_BANK/U_OB_WRP (OB13.SHCP), U_OB_BANK/U_OB_WRP (OB12.SHCP), U_OB_BANK/U_OB_WRP (OB11.SHCP), U_OB_BANK/U_OB_WRP (OB10.SHCP), U_OB_BANK/U_OB_WRP (OB9.SHCP), U_OB_BANK/U_OB_WRP (OB8.SHCP), U_OB_BANK/U_OB_WRP (OB7.SHCP), U_OB_BANK/U_OB_WRP (OB6.SHCP), U_OB_BANK/U_OB_WRP (OB5.SHCP), U_OB_BANK/U_OB_WRP (OB4.SHCP), U_OB_BANK/U_OB_WRP (OB3.SHCP), U_OB_BANK/U_OB_WRP (OB2.SHCP), U_OB_BANK/U_OB_WRP (OB1.SHCP), U_HEADER_BANK/U_COMBINED_HEADER_WRP/U_BOTTOM_HEADER_WRP (ETH1_U_BOTTOM_HEADER_WRP1.19)
FPGA_STCP: U_OB_BANK/U_OB_WRP (OB16.STCP), U_OB_BANK/U_OB_WRP (OB15.STCP), U_OB_BANK/U_OB_WRP (OB14.STCP), U_OB_BANK/U_OB_WRP (OB13.STCP), U_OB_BANK/U_OB_WRP (OB12.STCP), U_OB_BANK/U_OB_WRP (OB11.STCP), U_OB_BANK/U_OB_WRP (OB10.STCP), U_OB_BANK/U_OB_WRP (OB9.STCP), U_OB_BANK/U_OB_WRP (OB8.STCP), U_OB_BANK/U_OB_WRP (OB7.STCP), U_OB_BANK/U_OB_WRP (OB6.STCP), U_OB_BANK/U_OB_WRP (OB5.STCP), U_OB_BANK/U_OB_WRP (OB4.STCP), U_OB_BANK/U_OB_WRP (OB3.STCP), U_OB_BANK/U_OB_WRP (OB2.STCP), U_OB_BANK/U_OB_WRP (OB1.STCP), U_HEADER_BANK/U_COMBINED_HEADER_WRP/U_BOTTOM_HEADER_WRP (ETH1_U_BOTTOM_HEADER_WRP1.18)
FPGA_~CS1: U_SRAM_BANK/U_SRAM_WRP (S7.~CS), U_SRAM_BANK/U_SRAM_WRP (S8.~CS), U_HEADER_BANK/U_COMBINED_HEADER_WRP/U_BOTTOM_HEADER_WRP (ETH1_U_BOTTOM_HEADER_WRP4.24)
FPGA_~CS2: U_SRAM_BANK/U_SRAM_WRP (S6.~CS), U_SRAM_BANK/U_SRAM_WRP (S5.~CS), U_HEADER_BANK/U_COMBINED_HEADER_WRP/U_BOTTOM_HEADER_WRP (ETH1_U_BOTTOM_HEADER_WRP3.24)
FPGA_~CS3: U_SRAM_BANK/U_SRAM_WRP (S4.~CS), U_SRAM_BANK/U_SRAM_WRP (S3.~CS), U_HEADER_BANK/U_COMBINED_HEADER_WRP/U_BOTTOM_HEADER_WRP (ETH1_U_BOTTOM_HEADER_WRP2.24)
FPGA_~CS4: U_SRAM_BANK/U_SRAM_WRP (S2.~CS), U_SRAM_BANK/U_SRAM_WRP (S1.~CS), U_HEADER_BANK/U_COMBINED_HEADER_WRP/U_BOTTOM_HEADER_WRP (ETH1_U_BOTTOM_HEADER_WRP1.24)
FPGA_~MR: U_OB_BANK/U_OB_WRP (OB16.~MR), U_OB_BANK/U_OB_WRP (OB15.~MR), U_OB_BANK/U_OB_WRP (OB14.~MR), U_OB_BANK/U_OB_WRP (OB13.~MR), U_OB_BANK/U_OB_WRP (OB12.~MR), U_OB_BANK/U_OB_WRP (OB11.~MR), U_OB_BANK/U_OB_WRP (OB10.~MR), U_OB_BANK/U_OB_WRP (OB9.~MR), U_OB_BANK/U_OB_WRP (OB8.~MR), U_OB_BANK/U_OB_WRP (OB7.~MR), U_OB_BANK/U_OB_WRP (OB6.~MR), U_OB_BANK/U_OB_WRP (OB5.~MR), U_OB_BANK/U_OB_WRP (OB4.~MR), U_OB_BANK/U_OB_WRP (OB3.~MR), U_OB_BANK/U_OB_WRP (OB2.~MR), U_OB_BANK/U_OB_WRP (OB1.~MR), U_HEADER_BANK/U_COMBINED_HEADER_WRP/U_BOTTOM_HEADER_WRP (ETH1_U_BOTTOM_HEADER_WRP1.22)
FPGA_~OE: U_SRAM_BANK/U_SRAM_WRP (S7.~OE), U_SRAM_BANK/U_SRAM_WRP (S8.~OE), U_SRAM_BANK/U_SRAM_WRP (S6.~OE), U_SRAM_BANK/U_SRAM_WRP (S5.~OE), U_SRAM_BANK/U_SRAM_WRP (S4.~OE), U_SRAM_BANK/U_SRAM_WRP (S3.~OE), U_SRAM_BANK/U_SRAM_WRP (S2.~OE), U_SRAM_BANK/U_SRAM_WRP (S1.~OE), U_HEADER_BANK/U_COMBINED_HEADER_WRP/U_BOTTOM_HEADER_WRP (ETH1_U_BOTTOM_HEADER_WRP4.23)
FPGA_~PL: U_OB_BANK/U_OB_WRP (OB16.~PL), U_OB_BANK/U_OB_WRP (OB15.~PL), U_OB_BANK/U_OB_WRP (OB14.~PL), U_OB_BANK/U_OB_WRP (OB13.~PL), U_OB_BANK/U_OB_WRP (OB12.~PL), U_OB_BANK/U_OB_WRP (OB11.~PL), U_OB_BANK/U_OB_WRP (OB10.~PL), U_OB_BANK/U_OB_WRP (OB9.~PL), U_OB_BANK/U_OB_WRP (OB8.~PL), U_OB_BANK/U_OB_WRP (OB7.~PL), U_OB_BANK/U_OB_WRP (OB6.~PL), U_OB_BANK/U_OB_WRP (OB5.~PL), U_OB_BANK/U_OB_WRP (OB4.~PL), U_OB_BANK/U_OB_WRP (OB3.~PL), U_OB_BANK/U_OB_WRP (OB2.~PL), U_OB_BANK/U_OB_WRP (OB1.~PL), U_HEADER_BANK/U_COMBINED_HEADER_WRP/U_BOTTOM_HEADER_WRP (ETH1_U_BOTTOM_HEADER_WRP1.20)
FPGA_~WE1: U_SRAM_BANK/U_SRAM_WRP (S7.~WE), U_SRAM_BANK/U_SRAM_WRP (S8.~WE), U_HEADER_BANK/U_COMBINED_HEADER_WRP/U_BOTTOM_HEADER_WRP (ETH1_U_BOTTOM_HEADER_WRP4.22)
FPGA_~WE2: U_SRAM_BANK/U_SRAM_WRP (S6.~WE), U_SRAM_BANK/U_SRAM_WRP (S5.~WE), U_HEADER_BANK/U_COMBINED_HEADER_WRP/U_BOTTOM_HEADER_WRP (ETH1_U_BOTTOM_HEADER_WRP3.23)
FPGA_~WE3: U_SRAM_BANK/U_SRAM_WRP (S4.~WE), U_SRAM_BANK/U_SRAM_WRP (S3.~WE), U_HEADER_BANK/U_COMBINED_HEADER_WRP/U_BOTTOM_HEADER_WRP (ETH1_U_BOTTOM_HEADER_WRP2.23)
FPGA_~WE4: U_SRAM_BANK/U_SRAM_WRP (S2.~WE), U_SRAM_BANK/U_SRAM_WRP (S1.~WE), U_HEADER_BANK/U_COMBINED_HEADER_WRP/U_BOTTOM_HEADER_WRP (ETH1_U_BOTTOM_HEADER_WRP1.23)
GLOBAL_HIGH_POWER: U_VT_BANK/U_VT_WRP (0.1uF_2#1.1 V14.VCC), U_VT_BANK/U_VT_WRP (0.1uF_2#2.1 V13.VCC), U_VT_BANK/U_VT_WRP (0.1uF_2#3.1 V16.VCC), U_VT_BANK/U_VT_WRP (0.1uF_2#4.1 V15.VCC), U_VT_BANK/U_VT_WRP (0.1uF_2#5.1 V12.VCC), U_VT_BANK/U_VT_WRP (0.1uF_2#6.1 V11.VCC), U_VT_BANK/U_VT_WRP (0.1uF_2#7.1 V10.VCC), U_VT_BANK/U_VT_WRP (0.1uF_2#8.1 V9.VCC), U_VT_BANK/U_VT_WRP (0.1uF_2#9.1 V8.VCC), U_VT_BANK/U_VT_WRP (0.1uF_2#10.1 V7.VCC), U_VT_BANK/U_VT_WRP (0.1uF_2#11.1 V6.VCC), U_VT_BANK/U_VT_WRP (0.1uF_2#12.1 V5.VCC), U_VT_BANK/U_VT_WRP (0.1uF_2#13.1 V4.VCC), U_VT_BANK/U_VT_WRP (0.1uF_2#14.1 V3.VCC), U_VT_BANK/U_VT_WRP (0.1uF_2#15.1 V2.VCC), U_VT_BANK/U_VT_WRP (0.1uF_2#16.1 V1.VCC), U_HEADER_BANK/U_COMBINED_HEADER_WRP/U_BOTTOM_HEADER_WRP (ETH1_U_BOTTOM_HEADER_WRP3.18)
INSIDE16: U_VT_BANK/U_VT_WRP (V16.IVCC0), ZIF_WRP (ZIF1.17), U_HEADER_BANK/U_COMBINED_HEADER_WRP/U_TOP_HEADER_WRP (TH7.40)
INSIDE16: U_VT_BANK/U_VT_WRP (V10.IVCC0), ZIF_WRP (ZIF1.49), U_HEADER_BANK/U_COMBINED_HEADER_WRP/U_TOP_HEADER_WRP (TH5.40)
INSIDE16: U_VT_BANK/U_VT_WRP (V6.IVCC0), ZIF_WRP (ZIF1.81), U_HEADER_BANK/U_COMBINED_HEADER_WRP/U_TOP_HEADER_WRP (TH3#1.40)
INSIDE16: U_VT_BANK/U_VT_WRP (V2.IVCC0), ZIF_WRP (ZIF1.113), U_HEADER_BANK/U_COMBINED_HEADER_WRP/U_TOP_HEADER_WRP (TH3#2.40)
INSIDE17: U_VT_BANK/U_VT_WRP (V16.IVCC1), ZIF_WRP (ZIF1.18), U_HEADER_BANK/U_COMBINED_HEADER_WRP/U_TOP_HEADER_WRP (TH7.39)
INSIDE17: U_VT_BANK/U_VT_WRP (V10.IVCC1), ZIF_WRP (ZIF1.50), U_HEADER_BANK/U_COMBINED_HEADER_WRP/U_TOP_HEADER_WRP (TH5.39)
INSIDE17: U_VT_BANK/U_VT_WRP (V6.IVCC1), ZIF_WRP (ZIF1.82), U_HEADER_BANK/U_COMBINED_HEADER_WRP/U_TOP_HEADER_WRP (TH3#1.39)
INSIDE17: U_VT_BANK/U_VT_WRP (V2.IVCC1), ZIF_WRP (ZIF1.114), U_HEADER_BANK/U_COMBINED_HEADER_WRP/U_TOP_HEADER_WRP (TH3#2.39)
INSIDE18: U_VT_BANK/U_VT_WRP (V16.IVCC2), ZIF_WRP (ZIF1.19), U_HEADER_BANK/U_COMBINED_HEADER_WRP/U_TOP_HEADER_WRP (TH7.38)
INSIDE18: U_VT_BANK/U_VT_WRP (V10.IVCC2), ZIF_WRP (ZIF1.51), U_HEADER_BANK/U_COMBINED_HEADER_WRP/U_TOP_HEADER_WRP (TH5.38)
INSIDE18: U_VT_BANK/U_VT_WRP (V6.IVCC2), ZIF_WRP (ZIF1.83), U_HEADER_BANK/U_COMBINED_HEADER_WRP/U_TOP_HEADER_WRP (TH3#1.38)
INSIDE18: U_VT_BANK/U_VT_WRP (V2.IVCC2), ZIF_WRP (ZIF1.115), U_HEADER_BANK/U_COMBINED_HEADER_WRP/U_TOP_HEADER_WRP (TH3#2.38)
INSIDE19: U_VT_BANK/U_VT_WRP (V16.IVCC3), ZIF_WRP (ZIF1.20), U_HEADER_BANK/U_COMBINED_HEADER_WRP/U_TOP_HEADER_WRP (TH7.37)
INSIDE19: U_VT_BANK/U_VT_WRP (V10.IVCC3), ZIF_WRP (ZIF1.52), U_HEADER_BANK/U_COMBINED_HEADER_WRP/U_TOP_HEADER_WRP (TH5.37)
INSIDE19: U_VT_BANK/U_VT_WRP (V6.IVCC3), ZIF_WRP (ZIF1.84), U_HEADER_BANK/U_COMBINED_HEADER_WRP/U_TOP_HEADER_WRP (TH3#1.37)
INSIDE19: U_VT_BANK/U_VT_WRP (V2.IVCC3), ZIF_WRP (ZIF1.116), U_HEADER_BANK/U_COMBINED_HEADER_WRP/U_TOP_HEADER_WRP (TH3#2.37)
INSIDE20: U_VT_BANK/U_VT_WRP (V16.IVCC4), ZIF_WRP (ZIF1.21), U_HEADER_BANK/U_COMBINED_HEADER_WRP/U_TOP_HEADER_WRP (TH7.36)
INSIDE20: U_VT_BANK/U_VT_WRP (V10.IVCC4), ZIF_WRP (ZIF1.53), U_HEADER_BANK/U_COMBINED_HEADER_WRP/U_TOP_HEADER_WRP (TH5.36)
INSIDE20: U_VT_BANK/U_VT_WRP (V6.IVCC4), ZIF_WRP (ZIF1.85), U_HEADER_BANK/U_COMBINED_HEADER_WRP/U_TOP_HEADER_WRP (TH3#1.36)
INSIDE20: U_VT_BANK/U_VT_WRP (V2.IVCC4), ZIF_WRP (ZIF1.117), U_HEADER_BANK/U_COMBINED_HEADER_WRP/U_TOP_HEADER_WRP (TH3#2.36)
INSIDE21: U_VT_BANK/U_VT_WRP (V16.IVCC5), ZIF_WRP (ZIF1.22), U_HEADER_BANK/U_COMBINED_HEADER_WRP/U_TOP_HEADER_WRP (TH7.35)
INSIDE21: U_VT_BANK/U_VT_WRP (V10.IVCC5), ZIF_WRP (ZIF1.54), U_HEADER_BANK/U_COMBINED_HEADER_WRP/U_TOP_HEADER_WRP (TH5.35)
INSIDE21: U_VT_BANK/U_VT_WRP (V6.IVCC5), ZIF_WRP (ZIF1.86), U_HEADER_BANK/U_COMBINED_HEADER_WRP/U_TOP_HEADER_WRP (TH3#1.35)
INSIDE21: U_VT_BANK/U_VT_WRP (V2.IVCC5), ZIF_WRP (ZIF1.118), U_HEADER_BANK/U_COMBINED_HEADER_WRP/U_TOP_HEADER_WRP (TH3#2.35)
INSIDE22: U_VT_BANK/U_VT_WRP (V16.IVCC6), ZIF_WRP (ZIF1.23), U_HEADER_BANK/U_COMBINED_HEADER_WRP/U_TOP_HEADER_WRP (TH7.34)
INSIDE22: U_VT_BANK/U_VT_WRP (V10.IVCC6), ZIF_WRP (ZIF1.55), U_HEADER_BANK/U_COMBINED_HEADER_WRP/U_TOP_HEADER_WRP (TH5.34)
INSIDE22: U_VT_BANK/U_VT_WRP (V6.IVCC6), ZIF_WRP (ZIF1.87), U_HEADER_BANK/U_COMBINED_HEADER_WRP/U_TOP_HEADER_WRP (TH3#1.34)
INSIDE22: U_VT_BANK/U_VT_WRP (V2.IVCC6), ZIF_WRP (ZIF1.119), U_HEADER_BANK/U_COMBINED_HEADER_WRP/U_TOP_HEADER_WRP (TH3#2.34)
INSIDE23: U_VT_BANK/U_VT_WRP (V16.IVCC7), ZIF_WRP (ZIF1.24), U_HEADER_BANK/U_COMBINED_HEADER_WRP/U_TOP_HEADER_WRP (TH7.33)
INSIDE23: U_VT_BANK/U_VT_WRP (V10.IVCC7), ZIF_WRP (ZIF1.56), U_HEADER_BANK/U_COMBINED_HEADER_WRP/U_TOP_HEADER_WRP (TH5.33)
INSIDE23: U_VT_BANK/U_VT_WRP (V6.IVCC7), ZIF_WRP (ZIF1.88), U_HEADER_BANK/U_COMBINED_HEADER_WRP/U_TOP_HEADER_WRP (TH3#1.33)
INSIDE23: U_VT_BANK/U_VT_WRP (V2.IVCC7), ZIF_WRP (ZIF1.120), U_HEADER_BANK/U_COMBINED_HEADER_WRP/U_TOP_HEADER_WRP (TH3#2.33)
INSIDE24: U_VT_BANK/U_VT_WRP (V15.IVCC0), ZIF_WRP (ZIF1.25), U_HEADER_BANK/U_COMBINED_HEADER_WRP/U_TOP_HEADER_WRP (TH7.32)
INSIDE24: U_VT_BANK/U_VT_WRP (V9.IVCC0), ZIF_WRP (ZIF1.57), U_HEADER_BANK/U_COMBINED_HEADER_WRP/U_TOP_HEADER_WRP (TH5.32)
INSIDE24: U_VT_BANK/U_VT_WRP (V5.IVCC0), ZIF_WRP (ZIF1.89), U_HEADER_BANK/U_COMBINED_HEADER_WRP/U_TOP_HEADER_WRP (TH3#1.32)
INSIDE24: U_VT_BANK/U_VT_WRP (V1.IVCC0), ZIF_WRP (ZIF1.121), U_HEADER_BANK/U_COMBINED_HEADER_WRP/U_TOP_HEADER_WRP (TH3#2.32)
INSIDE25: U_VT_BANK/U_VT_WRP (V15.IVCC1), ZIF_WRP (ZIF1.26), U_HEADER_BANK/U_COMBINED_HEADER_WRP/U_TOP_HEADER_WRP (TH7.31)
INSIDE25: U_VT_BANK/U_VT_WRP (V9.IVCC1), ZIF_WRP (ZIF1.58), U_HEADER_BANK/U_COMBINED_HEADER_WRP/U_TOP_HEADER_WRP (TH5.31)
INSIDE25: U_VT_BANK/U_VT_WRP (V5.IVCC1), ZIF_WRP (ZIF1.90), U_HEADER_BANK/U_COMBINED_HEADER_WRP/U_TOP_HEADER_WRP (TH3#1.31)
INSIDE25: U_VT_BANK/U_VT_WRP (V1.IVCC1), ZIF_WRP (ZIF1.122), U_HEADER_BANK/U_COMBINED_HEADER_WRP/U_TOP_HEADER_WRP (TH3#2.31)
INSIDE26: U_VT_BANK/U_VT_WRP (V15.IVCC2), ZIF_WRP (ZIF1.27), U_HEADER_BANK/U_COMBINED_HEADER_WRP/U_TOP_HEADER_WRP (TH7.30)
INSIDE26: U_VT_BANK/U_VT_WRP (V9.IVCC2), ZIF_WRP (ZIF1.59), U_HEADER_BANK/U_COMBINED_HEADER_WRP/U_TOP_HEADER_WRP (TH5.30)
INSIDE26: U_VT_BANK/U_VT_WRP (V5.IVCC2), ZIF_WRP (ZIF1.91), U_HEADER_BANK/U_COMBINED_HEADER_WRP/U_TOP_HEADER_WRP (TH3#1.30)
INSIDE26: U_VT_BANK/U_VT_WRP (V1.IVCC2), ZIF_WRP (ZIF1.123), U_HEADER_BANK/U_COMBINED_HEADER_WRP/U_TOP_HEADER_WRP (TH3#2.30)
INSIDE27: U_VT_BANK/U_VT_WRP (V15.IVCC3), ZIF_WRP (ZIF1.28), U_HEADER_BANK/U_COMBINED_HEADER_WRP/U_TOP_HEADER_WRP (TH7.29)
INSIDE27: U_VT_BANK/U_VT_WRP (V9.IVCC3), ZIF_WRP (ZIF1.60), U_HEADER_BANK/U_COMBINED_HEADER_WRP/U_TOP_HEADER_WRP (TH5.29)
INSIDE27: U_VT_BANK/U_VT_WRP (V5.IVCC3), ZIF_WRP (ZIF1.92), U_HEADER_BANK/U_COMBINED_HEADER_WRP/U_TOP_HEADER_WRP (TH3#1.29)
INSIDE27: U_VT_BANK/U_VT_WRP (V1.IVCC3), ZIF_WRP (ZIF1.124), U_HEADER_BANK/U_COMBINED_HEADER_WRP/U_TOP_HEADER_WRP (TH3#2.29)
INSIDE28: U_VT_BANK/U_VT_WRP (V15.IVCC4), ZIF_WRP (ZIF1.29), U_HEADER_BANK/U_COMBINED_HEADER_WRP/U_TOP_HEADER_WRP (TH7.28)
INSIDE28: U_VT_BANK/U_VT_WRP (V9.IVCC4), ZIF_WRP (ZIF1.61), U_HEADER_BANK/U_COMBINED_HEADER_WRP/U_TOP_HEADER_WRP (TH5.28)
INSIDE28: U_VT_BANK/U_VT_WRP (V5.IVCC4), ZIF_WRP (ZIF1.93), U_HEADER_BANK/U_COMBINED_HEADER_WRP/U_TOP_HEADER_WRP (TH3#1.28)
INSIDE28: U_VT_BANK/U_VT_WRP (V1.IVCC4), ZIF_WRP (ZIF1.125), U_HEADER_BANK/U_COMBINED_HEADER_WRP/U_TOP_HEADER_WRP (TH3#2.28)
INSIDE29: U_VT_BANK/U_VT_WRP (V15.IVCC5), ZIF_WRP (ZIF1.30), U_HEADER_BANK/U_COMBINED_HEADER_WRP/U_TOP_HEADER_WRP (TH7.27)
INSIDE29: U_VT_BANK/U_VT_WRP (V9.IVCC5), ZIF_WRP (ZIF1.62), U_HEADER_BANK/U_COMBINED_HEADER_WRP/U_TOP_HEADER_WRP (TH5.27)
INSIDE29: U_VT_BANK/U_VT_WRP (V5.IVCC5), ZIF_WRP (ZIF1.94), U_HEADER_BANK/U_COMBINED_HEADER_WRP/U_TOP_HEADER_WRP (TH3#1.27)
INSIDE29: U_VT_BANK/U_VT_WRP (V1.IVCC5), ZIF_WRP (ZIF1.126), U_HEADER_BANK/U_COMBINED_HEADER_WRP/U_TOP_HEADER_WRP (TH3#2.27)
INSIDE30: U_VT_BANK/U_VT_WRP (V15.IVCC6), ZIF_WRP (ZIF1.31), U_HEADER_BANK/U_COMBINED_HEADER_WRP/U_TOP_HEADER_WRP (TH7.26)
INSIDE30: U_VT_BANK/U_VT_WRP (V9.IVCC6), ZIF_WRP (ZIF1.63), U_HEADER_BANK/U_COMBINED_HEADER_WRP/U_TOP_HEADER_WRP (TH5.26)
INSIDE30: U_VT_BANK/U_VT_WRP (V5.IVCC6), ZIF_WRP (ZIF1.95), U_HEADER_BANK/U_COMBINED_HEADER_WRP/U_TOP_HEADER_WRP (TH3#1.26)
INSIDE30: U_VT_BANK/U_VT_WRP (V1.IVCC6), ZIF_WRP (ZIF1.127), U_HEADER_BANK/U_COMBINED_HEADER_WRP/U_TOP_HEADER_WRP (TH3#2.26)
INSIDE31: U_VT_BANK/U_VT_WRP (V15.IVCC7), ZIF_WRP (ZIF1.32), U_HEADER_BANK/U_COMBINED_HEADER_WRP/U_TOP_HEADER_WRP (TH7.25)
INSIDE31: U_VT_BANK/U_VT_WRP (V9.IVCC7), ZIF_WRP (ZIF1.64), U_HEADER_BANK/U_COMBINED_HEADER_WRP/U_TOP_HEADER_WRP (TH5.25)
INSIDE31: U_VT_BANK/U_VT_WRP (V5.IVCC7), ZIF_WRP (ZIF1.96), U_HEADER_BANK/U_COMBINED_HEADER_WRP/U_TOP_HEADER_WRP (TH3#1.25)
INSIDE31: U_VT_BANK/U_VT_WRP (V1.IVCC7), ZIF_WRP (ZIF1.128), U_HEADER_BANK/U_COMBINED_HEADER_WRP/U_TOP_HEADER_WRP (TH3#2.25)
INSIDE_B0: U_VT_BANK/U_VT_WRP (V14.IVCC0), ZIF_WRP (ZIF1.1), U_HEADER_BANK/U_COMBINED_HEADER_WRP/U_TOP_HEADER_WRP (TH8.40)
INSIDE_B1: U_VT_BANK/U_VT_WRP (V14.IVCC1), ZIF_WRP (ZIF1.2), U_HEADER_BANK/U_COMBINED_HEADER_WRP/U_TOP_HEADER_WRP (TH8.39)
INSIDE_B2: U_VT_BANK/U_VT_WRP (V14.IVCC2), ZIF_WRP (ZIF1.3), U_HEADER_BANK/U_COMBINED_HEADER_WRP/U_TOP_HEADER_WRP (TH8.38)
INSIDE_B3: U_VT_BANK/U_VT_WRP (V14.IVCC3), ZIF_WRP (ZIF1.4), U_HEADER_BANK/U_COMBINED_HEADER_WRP/U_TOP_HEADER_WRP (TH8.37)
INSIDE_B4: U_VT_BANK/U_VT_WRP (V14.IVCC4), ZIF_WRP (ZIF1.5), U_HEADER_BANK/U_COMBINED_HEADER_WRP/U_TOP_HEADER_WRP (TH8.36)
INSIDE_B5: U_VT_BANK/U_VT_WRP (V14.IVCC5), ZIF_WRP (ZIF1.6), U_HEADER_BANK/U_COMBINED_HEADER_WRP/U_TOP_HEADER_WRP (TH8.35)
INSIDE_B6: U_VT_BANK/U_VT_WRP (V14.IVCC6), ZIF_WRP (ZIF1.7), U_HEADER_BANK/U_COMBINED_HEADER_WRP/U_TOP_HEADER_WRP (TH8.34)
INSIDE_B7: U_VT_BANK/U_VT_WRP (V14.IVCC7), ZIF_WRP (ZIF1.8), U_HEADER_BANK/U_COMBINED_HEADER_WRP/U_TOP_HEADER_WRP (TH8.33)
INSIDE_B8: U_VT_BANK/U_VT_WRP (V13.IVCC0), ZIF_WRP (ZIF1.9), U_HEADER_BANK/U_COMBINED_HEADER_WRP/U_TOP_HEADER_WRP (TH8.32)
INSIDE_B9: U_VT_BANK/U_VT_WRP (V13.IVCC1), ZIF_WRP (ZIF1.10), U_HEADER_BANK/U_COMBINED_HEADER_WRP/U_TOP_HEADER_WRP (TH8.31)
INSIDE_B10: U_VT_BANK/U_VT_WRP (V13.IVCC2), ZIF_WRP (ZIF1.11), U_HEADER_BANK/U_COMBINED_HEADER_WRP/U_TOP_HEADER_WRP (TH8.30)
INSIDE_B11: U_VT_BANK/U_VT_WRP (V13.IVCC3), ZIF_WRP (ZIF1.12), U_HEADER_BANK/U_COMBINED_HEADER_WRP/U_TOP_HEADER_WRP (TH8.29)
INSIDE_B12: U_VT_BANK/U_VT_WRP (V13.IVCC4), ZIF_WRP (ZIF1.13), U_HEADER_BANK/U_COMBINED_HEADER_WRP/U_TOP_HEADER_WRP (TH8.28)
INSIDE_B13: U_VT_BANK/U_VT_WRP (V13.IVCC5), ZIF_WRP (ZIF1.14), U_HEADER_BANK/U_COMBINED_HEADER_WRP/U_TOP_HEADER_WRP (TH8.27)
INSIDE_B14: U_VT_BANK/U_VT_WRP (V13.IVCC6), ZIF_WRP (ZIF1.15), U_HEADER_BANK/U_COMBINED_HEADER_WRP/U_TOP_HEADER_WRP (TH8.26)
INSIDE_B15: U_VT_BANK/U_VT_WRP (V13.IVCC7), ZIF_WRP (ZIF1.16), U_HEADER_BANK/U_COMBINED_HEADER_WRP/U_TOP_HEADER_WRP (TH8.25)
INSIDE_B32: U_VT_BANK/U_VT_WRP (V12.IVCC0), ZIF_WRP (ZIF1.33), U_HEADER_BANK/U_COMBINED_HEADER_WRP/U_TOP_HEADER_WRP (TH6.40)
INSIDE_B33: U_VT_BANK/U_VT_WRP (V12.IVCC1), ZIF_WRP (ZIF1.34), U_HEADER_BANK/U_COMBINED_HEADER_WRP/U_TOP_HEADER_WRP (TH6.39)
INSIDE_B34: U_VT_BANK/U_VT_WRP (V12.IVCC2), ZIF_WRP (ZIF1.35), U_HEADER_BANK/U_COMBINED_HEADER_WRP/U_TOP_HEADER_WRP (TH6.38)
INSIDE_B35: U_VT_BANK/U_VT_WRP (V12.IVCC3), ZIF_WRP (ZIF1.36), U_HEADER_BANK/U_COMBINED_HEADER_WRP/U_TOP_HEADER_WRP (TH6.37)
INSIDE_B36: U_VT_BANK/U_VT_WRP (V12.IVCC4), ZIF_WRP (ZIF1.37), U_HEADER_BANK/U_COMBINED_HEADER_WRP/U_TOP_HEADER_WRP (TH6.36)
INSIDE_B37: U_VT_BANK/U_VT_WRP (V12.IVCC5), ZIF_WRP (ZIF1.38), U_HEADER_BANK/U_COMBINED_HEADER_WRP/U_TOP_HEADER_WRP (TH6.35)
INSIDE_B38: U_VT_BANK/U_VT_WRP (V12.IVCC6), ZIF_WRP (ZIF1.39), U_HEADER_BANK/U_COMBINED_HEADER_WRP/U_TOP_HEADER_WRP (TH6.34)
INSIDE_B39: U_VT_BANK/U_VT_WRP (V12.IVCC7), ZIF_WRP (ZIF1.40), U_HEADER_BANK/U_COMBINED_HEADER_WRP/U_TOP_HEADER_WRP (TH6.33)
INSIDE_B40: U_VT_BANK/U_VT_WRP (V11.IVCC0), ZIF_WRP (ZIF1.41), U_HEADER_BANK/U_COMBINED_HEADER_WRP/U_TOP_HEADER_WRP (TH6.32)
INSIDE_B41: U_VT_BANK/U_VT_WRP (V11.IVCC1), ZIF_WRP (ZIF1.42), U_HEADER_BANK/U_COMBINED_HEADER_WRP/U_TOP_HEADER_WRP (TH6.31)
INSIDE_B42: U_VT_BANK/U_VT_WRP (V11.IVCC2), ZIF_WRP (ZIF1.43), U_HEADER_BANK/U_COMBINED_HEADER_WRP/U_TOP_HEADER_WRP (TH6.30)
INSIDE_B43: U_VT_BANK/U_VT_WRP (V11.IVCC3), ZIF_WRP (ZIF1.44), U_HEADER_BANK/U_COMBINED_HEADER_WRP/U_TOP_HEADER_WRP (TH6.29)
INSIDE_B44: U_VT_BANK/U_VT_WRP (V11.IVCC4), ZIF_WRP (ZIF1.45), U_HEADER_BANK/U_COMBINED_HEADER_WRP/U_TOP_HEADER_WRP (TH6.28)
INSIDE_B45: U_VT_BANK/U_VT_WRP (V11.IVCC5), ZIF_WRP (ZIF1.46), U_HEADER_BANK/U_COMBINED_HEADER_WRP/U_TOP_HEADER_WRP (TH6.27)
INSIDE_B46: U_VT_BANK/U_VT_WRP (V11.IVCC6), ZIF_WRP (ZIF1.47), U_HEADER_BANK/U_COMBINED_HEADER_WRP/U_TOP_HEADER_WRP (TH6.26)
INSIDE_B47: U_VT_BANK/U_VT_WRP (V11.IVCC7), ZIF_WRP (ZIF1.48), U_HEADER_BANK/U_COMBINED_HEADER_WRP/U_TOP_HEADER_WRP (TH6.25)
INSIDE_B64: U_VT_BANK/U_VT_WRP (V8.IVCC0), ZIF_WRP (ZIF1.65), U_HEADER_BANK/U_COMBINED_HEADER_WRP/U_TOP_HEADER_WRP (TH4.40)
INSIDE_B65: U_VT_BANK/U_VT_WRP (V8.IVCC1), ZIF_WRP (ZIF1.66), U_HEADER_BANK/U_COMBINED_HEADER_WRP/U_TOP_HEADER_WRP (TH4.39)
INSIDE_B66: U_VT_BANK/U_VT_WRP (V8.IVCC2), ZIF_WRP (ZIF1.67), U_HEADER_BANK/U_COMBINED_HEADER_WRP/U_TOP_HEADER_WRP (TH4.38)
INSIDE_B67: U_VT_BANK/U_VT_WRP (V8.IVCC3), ZIF_WRP (ZIF1.68), U_HEADER_BANK/U_COMBINED_HEADER_WRP/U_TOP_HEADER_WRP (TH4.37)
INSIDE_B68: U_VT_BANK/U_VT_WRP (V8.IVCC4), ZIF_WRP (ZIF1.69), U_HEADER_BANK/U_COMBINED_HEADER_WRP/U_TOP_HEADER_WRP (TH4.36)
INSIDE_B69: U_VT_BANK/U_VT_WRP (V8.IVCC5), ZIF_WRP (ZIF1.70), U_HEADER_BANK/U_COMBINED_HEADER_WRP/U_TOP_HEADER_WRP (TH4.35)
INSIDE_B70: U_VT_BANK/U_VT_WRP (V8.IVCC6), ZIF_WRP (ZIF1.71), U_HEADER_BANK/U_COMBINED_HEADER_WRP/U_TOP_HEADER_WRP (TH4.34)
INSIDE_B71: U_VT_BANK/U_VT_WRP (V8.IVCC7), ZIF_WRP (ZIF1.72), U_HEADER_BANK/U_COMBINED_HEADER_WRP/U_TOP_HEADER_WRP (TH4.33)
INSIDE_B72: U_VT_BANK/U_VT_WRP (V7.IVCC0), ZIF_WRP (ZIF1.73), U_HEADER_BANK/U_COMBINED_HEADER_WRP/U_TOP_HEADER_WRP (TH4.32)
INSIDE_B73: U_VT_BANK/U_VT_WRP (V7.IVCC1), ZIF_WRP (ZIF1.74), U_HEADER_BANK/U_COMBINED_HEADER_WRP/U_TOP_HEADER_WRP (TH4.31)
INSIDE_B74: U_VT_BANK/U_VT_WRP (V7.IVCC2), ZIF_WRP (ZIF1.75), U_HEADER_BANK/U_COMBINED_HEADER_WRP/U_TOP_HEADER_WRP (TH4.30)
INSIDE_B75: U_VT_BANK/U_VT_WRP (V7.IVCC3), ZIF_WRP (ZIF1.76), U_HEADER_BANK/U_COMBINED_HEADER_WRP/U_TOP_HEADER_WRP (TH4.29)
INSIDE_B76: U_VT_BANK/U_VT_WRP (V7.IVCC4), ZIF_WRP (ZIF1.77), U_HEADER_BANK/U_COMBINED_HEADER_WRP/U_TOP_HEADER_WRP (TH4.28)
INSIDE_B77: U_VT_BANK/U_VT_WRP (V7.IVCC5), ZIF_WRP (ZIF1.78), U_HEADER_BANK/U_COMBINED_HEADER_WRP/U_TOP_HEADER_WRP (TH4.27)
INSIDE_B78: U_VT_BANK/U_VT_WRP (V7.IVCC6), ZIF_WRP (ZIF1.79), U_HEADER_BANK/U_COMBINED_HEADER_WRP/U_TOP_HEADER_WRP (TH4.26)
INSIDE_B79: U_VT_BANK/U_VT_WRP (V7.IVCC7), ZIF_WRP (ZIF1.80), U_HEADER_BANK/U_COMBINED_HEADER_WRP/U_TOP_HEADER_WRP (TH4.25)
INSIDE_B96: U_VT_BANK/U_VT_WRP (V4.IVCC0), ZIF_WRP (ZIF1.97), U_HEADER_BANK/U_COMBINED_HEADER_WRP/U_TOP_HEADER_WRP (TH2.40)
INSIDE_B97: U_VT_BANK/U_VT_WRP (V4.IVCC1), ZIF_WRP (ZIF1.98), U_HEADER_BANK/U_COMBINED_HEADER_WRP/U_TOP_HEADER_WRP (TH2.39)
INSIDE_B98: U_VT_BANK/U_VT_WRP (V4.IVCC2), ZIF_WRP (ZIF1.99), U_HEADER_BANK/U_COMBINED_HEADER_WRP/U_TOP_HEADER_WRP (TH2.38)
INSIDE_B99: U_VT_BANK/U_VT_WRP (V4.IVCC3), ZIF_WRP (ZIF1.100), U_HEADER_BANK/U_COMBINED_HEADER_WRP/U_TOP_HEADER_WRP (TH2.37)
INSIDE_B100: U_VT_BANK/U_VT_WRP (V4.IVCC4), ZIF_WRP (ZIF1.101), U_HEADER_BANK/U_COMBINED_HEADER_WRP/U_TOP_HEADER_WRP (TH2.36)
INSIDE_B101: U_VT_BANK/U_VT_WRP (V4.IVCC5), ZIF_WRP (ZIF1.102), U_HEADER_BANK/U_COMBINED_HEADER_WRP/U_TOP_HEADER_WRP (TH2.35)
INSIDE_B102: U_VT_BANK/U_VT_WRP (V4.IVCC6), ZIF_WRP (ZIF1.103), U_HEADER_BANK/U_COMBINED_HEADER_WRP/U_TOP_HEADER_WRP (TH2.34)
INSIDE_B103: U_VT_BANK/U_VT_WRP (V4.IVCC7), ZIF_WRP (ZIF1.104), U_HEADER_BANK/U_COMBINED_HEADER_WRP/U_TOP_HEADER_WRP (TH2.33)
INSIDE_B104: U_VT_BANK/U_VT_WRP (V3.IVCC0), ZIF_WRP (ZIF1.105), U_HEADER_BANK/U_COMBINED_HEADER_WRP/U_TOP_HEADER_WRP (TH2.32)
INSIDE_B105: U_VT_BANK/U_VT_WRP (V3.IVCC1), ZIF_WRP (ZIF1.106), U_HEADER_BANK/U_COMBINED_HEADER_WRP/U_TOP_HEADER_WRP (TH2.31)
INSIDE_B106: U_VT_BANK/U_VT_WRP (V3.IVCC2), ZIF_WRP (ZIF1.107), U_HEADER_BANK/U_COMBINED_HEADER_WRP/U_TOP_HEADER_WRP (TH2.30)
INSIDE_B107: U_VT_BANK/U_VT_WRP (V3.IVCC3), ZIF_WRP (ZIF1.108), U_HEADER_BANK/U_COMBINED_HEADER_WRP/U_TOP_HEADER_WRP (TH2.29)
INSIDE_B108: U_VT_BANK/U_VT_WRP (V3.IVCC4), ZIF_WRP (ZIF1.109), U_HEADER_BANK/U_COMBINED_HEADER_WRP/U_TOP_HEADER_WRP (TH2.28)
INSIDE_B109: U_VT_BANK/U_VT_WRP (V3.IVCC5), ZIF_WRP (ZIF1.110), U_HEADER_BANK/U_COMBINED_HEADER_WRP/U_TOP_HEADER_WRP (TH2.27)
INSIDE_B110: U_VT_BANK/U_VT_WRP (V3.IVCC6), ZIF_WRP (ZIF1.111), U_HEADER_BANK/U_COMBINED_HEADER_WRP/U_TOP_HEADER_WRP (TH2.26)
INSIDE_B111: U_VT_BANK/U_VT_WRP (V3.IVCC7), ZIF_WRP (ZIF1.112), U_HEADER_BANK/U_COMBINED_HEADER_WRP/U_TOP_HEADER_WRP (TH2.25)
OUTSIDE_L_W0: U_HEADER_BANK/U_COMBINED_HEADER_WRP/U_TOP_HEADER_WRP (TH8.1), U_HEADER_BANK/U_COMBINED_HEADER_WRP/U_BOTTOM_HEADER_WRP (ETH1_U_BOTTOM_HEADER_WRP4.1)
OUTSIDE_L_W0: U_HEADER_BANK/U_COMBINED_HEADER_WRP/U_TOP_HEADER_WRP (TH6.1), U_HEADER_BANK/U_COMBINED_HEADER_WRP/U_BOTTOM_HEADER_WRP (ETH1_U_BOTTOM_HEADER_WRP3.1)
OUTSIDE_L_W0: U_HEADER_BANK/U_COMBINED_HEADER_WRP/U_TOP_HEADER_WRP (TH4.1), U_HEADER_BANK/U_COMBINED_HEADER_WRP/U_BOTTOM_HEADER_WRP (ETH1_U_BOTTOM_HEADER_WRP2.1)
OUTSIDE_L_W0: U_HEADER_BANK/U_COMBINED_HEADER_WRP/U_TOP_HEADER_WRP (TH2.1), U_HEADER_BANK/U_COMBINED_HEADER_WRP/U_BOTTOM_HEADER_WRP (ETH1_U_BOTTOM_HEADER_WRP1.1)
OUTSIDE_L_W1: U_HEADER_BANK/U_COMBINED_HEADER_WRP/U_TOP_HEADER_WRP (TH8.2), U_HEADER_BANK/U_COMBINED_HEADER_WRP/U_BOTTOM_HEADER_WRP (ETH1_U_BOTTOM_HEADER_WRP4.2)
OUTSIDE_L_W1: U_HEADER_BANK/U_COMBINED_HEADER_WRP/U_TOP_HEADER_WRP (TH6.2), U_HEADER_BANK/U_COMBINED_HEADER_WRP/U_BOTTOM_HEADER_WRP (ETH1_U_BOTTOM_HEADER_WRP3.2)
OUTSIDE_L_W1: U_HEADER_BANK/U_COMBINED_HEADER_WRP/U_TOP_HEADER_WRP (TH4.2), U_HEADER_BANK/U_COMBINED_HEADER_WRP/U_BOTTOM_HEADER_WRP (ETH1_U_BOTTOM_HEADER_WRP2.2)
OUTSIDE_L_W1: U_HEADER_BANK/U_COMBINED_HEADER_WRP/U_TOP_HEADER_WRP (TH2.2), U_HEADER_BANK/U_COMBINED_HEADER_WRP/U_BOTTOM_HEADER_WRP (ETH1_U_BOTTOM_HEADER_WRP1.2)
OUTSIDE_L_W2: U_HEADER_BANK/U_COMBINED_HEADER_WRP/U_TOP_HEADER_WRP (TH8.3), U_HEADER_BANK/U_COMBINED_HEADER_WRP/U_BOTTOM_HEADER_WRP (ETH1_U_BOTTOM_HEADER_WRP4.3)
OUTSIDE_L_W2: U_HEADER_BANK/U_COMBINED_HEADER_WRP/U_TOP_HEADER_WRP (TH6.3), U_HEADER_BANK/U_COMBINED_HEADER_WRP/U_BOTTOM_HEADER_WRP (ETH1_U_BOTTOM_HEADER_WRP3.3)
OUTSIDE_L_W2: U_HEADER_BANK/U_COMBINED_HEADER_WRP/U_TOP_HEADER_WRP (TH4.3), U_HEADER_BANK/U_COMBINED_HEADER_WRP/U_BOTTOM_HEADER_WRP (ETH1_U_BOTTOM_HEADER_WRP2.3)
OUTSIDE_L_W2: U_HEADER_BANK/U_COMBINED_HEADER_WRP/U_TOP_HEADER_WRP (TH2.3), U_HEADER_BANK/U_COMBINED_HEADER_WRP/U_BOTTOM_HEADER_WRP (ETH1_U_BOTTOM_HEADER_WRP1.3)
OUTSIDE_L_W3: U_HEADER_BANK/U_COMBINED_HEADER_WRP/U_TOP_HEADER_WRP (TH8.4), U_HEADER_BANK/U_COMBINED_HEADER_WRP/U_BOTTOM_HEADER_WRP (ETH1_U_BOTTOM_HEADER_WRP4.4)
OUTSIDE_L_W3: U_HEADER_BANK/U_COMBINED_HEADER_WRP/U_TOP_HEADER_WRP (TH6.4), U_HEADER_BANK/U_COMBINED_HEADER_WRP/U_BOTTOM_HEADER_WRP (ETH1_U_BOTTOM_HEADER_WRP3.4)
OUTSIDE_L_W3: U_HEADER_BANK/U_COMBINED_HEADER_WRP/U_TOP_HEADER_WRP (TH4.4), U_HEADER_BANK/U_COMBINED_HEADER_WRP/U_BOTTOM_HEADER_WRP (ETH1_U_BOTTOM_HEADER_WRP2.4)
OUTSIDE_L_W3: U_HEADER_BANK/U_COMBINED_HEADER_WRP/U_TOP_HEADER_WRP (TH2.4), U_HEADER_BANK/U_COMBINED_HEADER_WRP/U_BOTTOM_HEADER_WRP (ETH1_U_BOTTOM_HEADER_WRP1.4)
OUTSIDE_L_W4: U_HEADER_BANK/U_COMBINED_HEADER_WRP/U_TOP_HEADER_WRP (TH8.5), U_HEADER_BANK/U_COMBINED_HEADER_WRP/U_BOTTOM_HEADER_WRP (ETH1_U_BOTTOM_HEADER_WRP4.5)
OUTSIDE_L_W4: U_HEADER_BANK/U_COMBINED_HEADER_WRP/U_TOP_HEADER_WRP (TH6.5), U_HEADER_BANK/U_COMBINED_HEADER_WRP/U_BOTTOM_HEADER_WRP (ETH1_U_BOTTOM_HEADER_WRP3.5)
OUTSIDE_L_W4: U_HEADER_BANK/U_COMBINED_HEADER_WRP/U_TOP_HEADER_WRP (TH4.5), U_HEADER_BANK/U_COMBINED_HEADER_WRP/U_BOTTOM_HEADER_WRP (ETH1_U_BOTTOM_HEADER_WRP2.5)
OUTSIDE_L_W4: U_HEADER_BANK/U_COMBINED_HEADER_WRP/U_TOP_HEADER_WRP (TH2.5), U_HEADER_BANK/U_COMBINED_HEADER_WRP/U_BOTTOM_HEADER_WRP (ETH1_U_BOTTOM_HEADER_WRP1.5)
OUTSIDE_L_W5: U_HEADER_BANK/U_COMBINED_HEADER_WRP/U_TOP_HEADER_WRP (TH8.6), U_HEADER_BANK/U_COMBINED_HEADER_WRP/U_BOTTOM_HEADER_WRP (ETH1_U_BOTTOM_HEADER_WRP4.6)
OUTSIDE_L_W5: U_HEADER_BANK/U_COMBINED_HEADER_WRP/U_TOP_HEADER_WRP (TH6.6), U_HEADER_BANK/U_COMBINED_HEADER_WRP/U_BOTTOM_HEADER_WRP (ETH1_U_BOTTOM_HEADER_WRP3.6)
OUTSIDE_L_W5: U_HEADER_BANK/U_COMBINED_HEADER_WRP/U_TOP_HEADER_WRP (TH4.6), U_HEADER_BANK/U_COMBINED_HEADER_WRP/U_BOTTOM_HEADER_WRP (ETH1_U_BOTTOM_HEADER_WRP2.6)
OUTSIDE_L_W5: U_HEADER_BANK/U_COMBINED_HEADER_WRP/U_TOP_HEADER_WRP (TH2.6), U_HEADER_BANK/U_COMBINED_HEADER_WRP/U_BOTTOM_HEADER_WRP (ETH1_U_BOTTOM_HEADER_WRP1.6)
OUTSIDE_L_W6: U_HEADER_BANK/U_COMBINED_HEADER_WRP/U_TOP_HEADER_WRP (TH8.7), U_HEADER_BANK/U_COMBINED_HEADER_WRP/U_BOTTOM_HEADER_WRP (ETH1_U_BOTTOM_HEADER_WRP4.7)
OUTSIDE_L_W6: U_HEADER_BANK/U_COMBINED_HEADER_WRP/U_TOP_HEADER_WRP (TH6.7), U_HEADER_BANK/U_COMBINED_HEADER_WRP/U_BOTTOM_HEADER_WRP (ETH1_U_BOTTOM_HEADER_WRP3.7)
OUTSIDE_L_W6: U_HEADER_BANK/U_COMBINED_HEADER_WRP/U_TOP_HEADER_WRP (TH4.7), U_HEADER_BANK/U_COMBINED_HEADER_WRP/U_BOTTOM_HEADER_WRP (ETH1_U_BOTTOM_HEADER_WRP2.7)